# Altium project python project v2.0.PrjPcb (part 1 of 2)
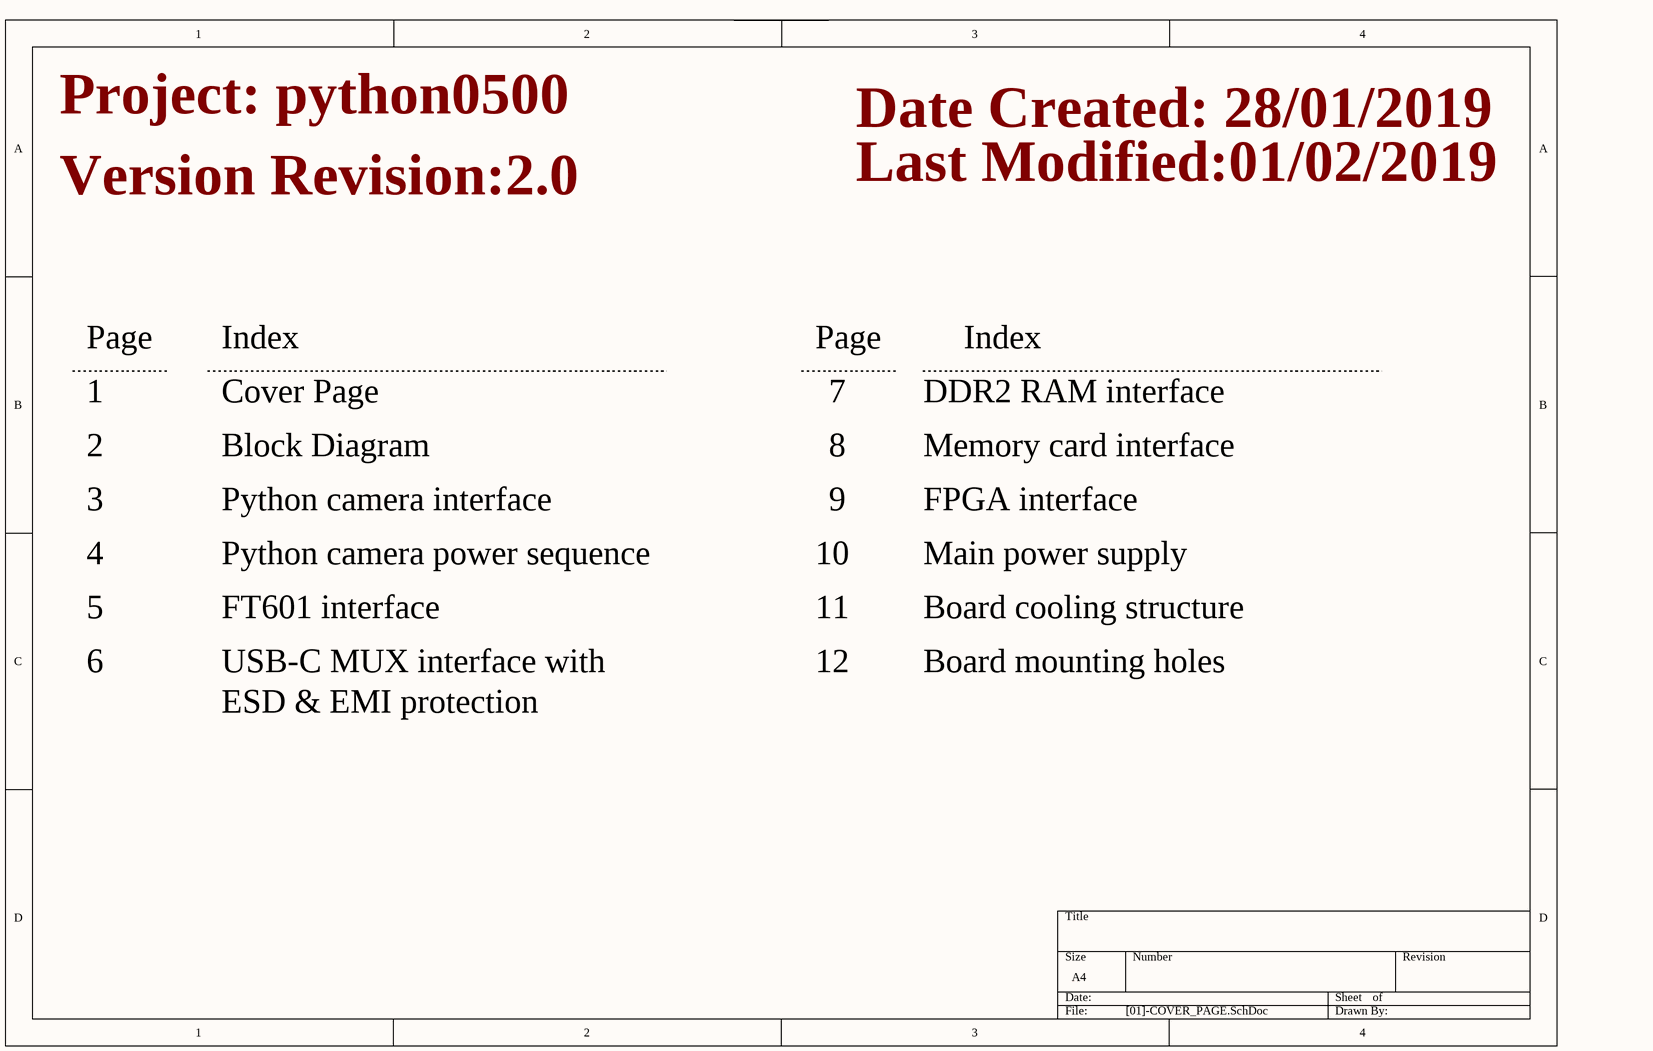
[diagram p0: [01]-COVER_PAGE.SchDoc]
17 sheets, 320 parts. Net scope: flat (ports and power ports of the same name join across sheets).
Board file: python project v2.0.PcbDoc
Sheets:
  [01]-COVER_PAGE.SchDoc
  [02]-BLOCK_DIAGRAM.SchDoc
  [03]-Python_Camera_Interface.SchDoc
  [04]-FT601_USB_Tx_Rx_Interface.SchDoc
  [05]-USB_C_MUX_Interface.SchDoc
  [06]-DDR2_Interface.SchDoc
  [07]-SDcard_Testpoints_Ext_SPI_Interface.SchDoc
  [08]-FPGA_Bank_1_Interface.SchDoc
  [09]-FPGA_Bank_2_Interface.SchDoc
  [10]-FPGA_Bank_3_Interface.SchDoc
  [11]-FPGA_Bank_4_Interface.SchDoc
  [12]-FPGA_Bank_5_Interface.SchDoc
  [13]-FPGA_Bank_6_Interface.SchDoc
  [14]-FPGA_Bank_7_Interface.SchDoc
  [15]-FPGA_Bank_8_Interface.SchDoc
  [16]-DDR2_Power_Supply.SchDoc
  [17]-FPGA_Power_Supply.SchDoc

## Sheet [01]-COVER_PAGE.SchDoc
size A4

### Notes on the sheet
- Project: python0500
- Date Created: 28/01/2019
- Last Modified:01/02/2019
- Version Revision:2.0
- Page
- Index
- 1
- 2
- Cover Page
- Block Diagram
- 7
- 8
- DDR2 RAM interface
- Memory card interface
- 3
- Python camera interface
- 9
- FPGA interface
- 4
- Python camera power sequence
- 10
- Main power supply
- 5
- FT601 interface
- 11
- Board cooling structure
- 6
- USB-C MUX interface with
- ESD & EMI protection
- 12
- Board mounting holes

## Sheet [02]-BLOCK_DIAGRAM.SchDoc
size A4
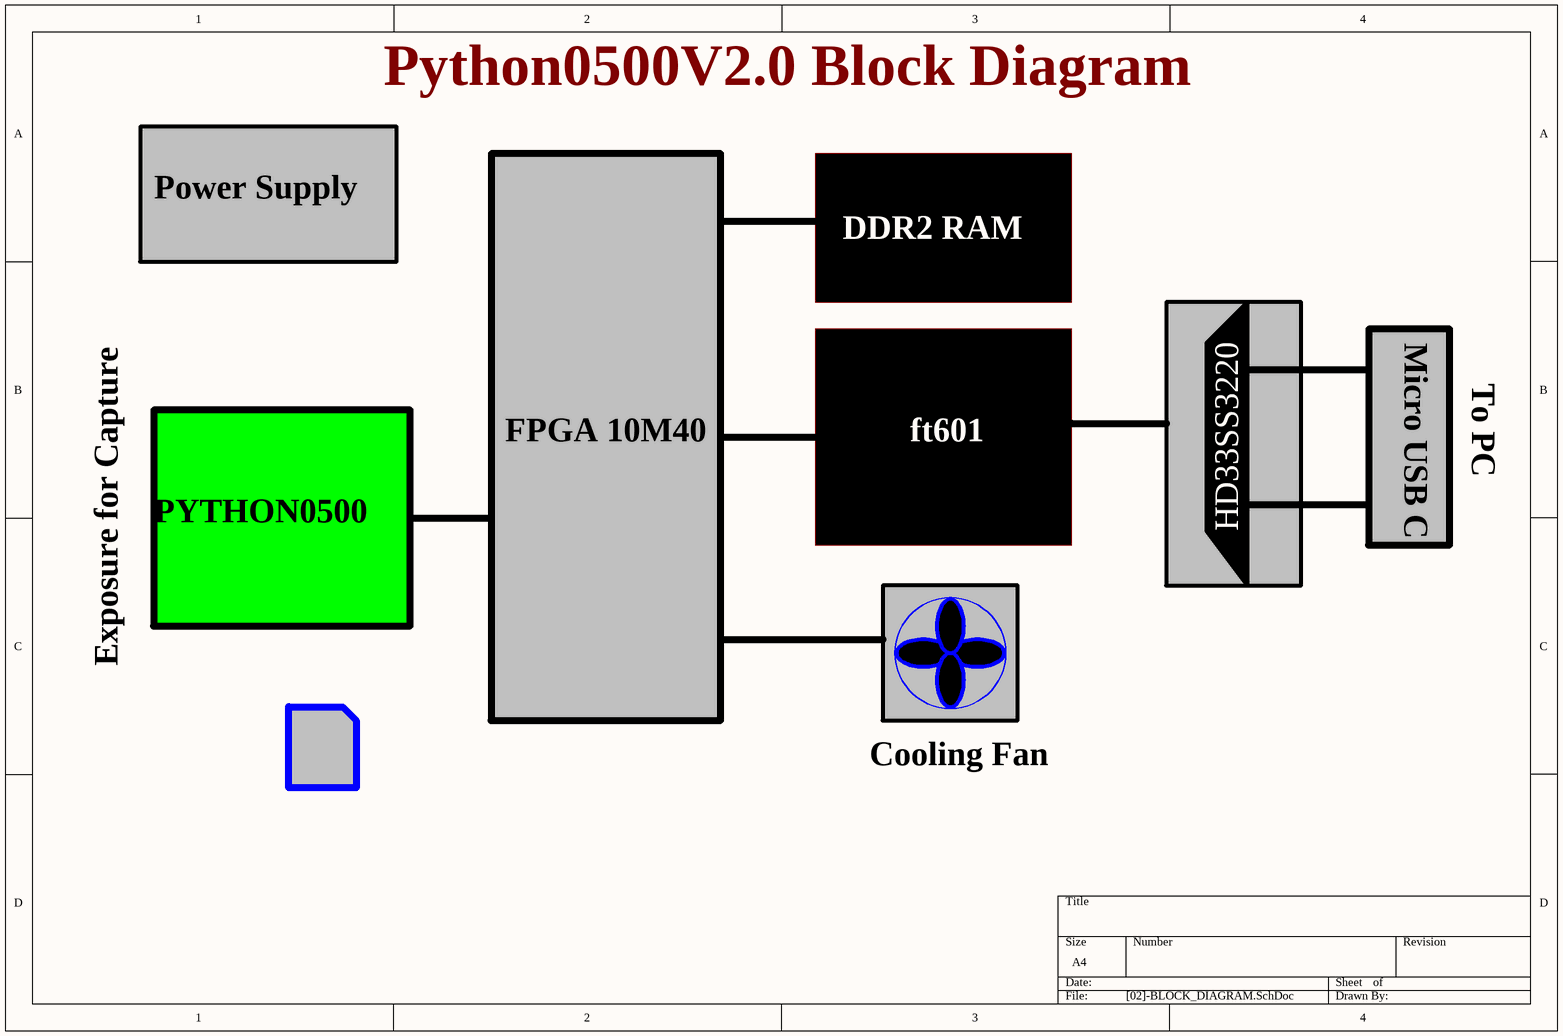
[diagram p1: [02]-BLOCK_DIAGRAM.SchDoc]

### Notes on the sheet
- Python0500V2.0 Block Diagram
- Power Supply
- DDR2 RAM
- Micro USB C
- To PC
- FPGA 10M40
- ft601
- PYTHON0500
- HD33SS3220
- Exposure for Capture
- Cooling Fan

## Sheet [03]-Python_Camera_Interface.SchDoc
size A4
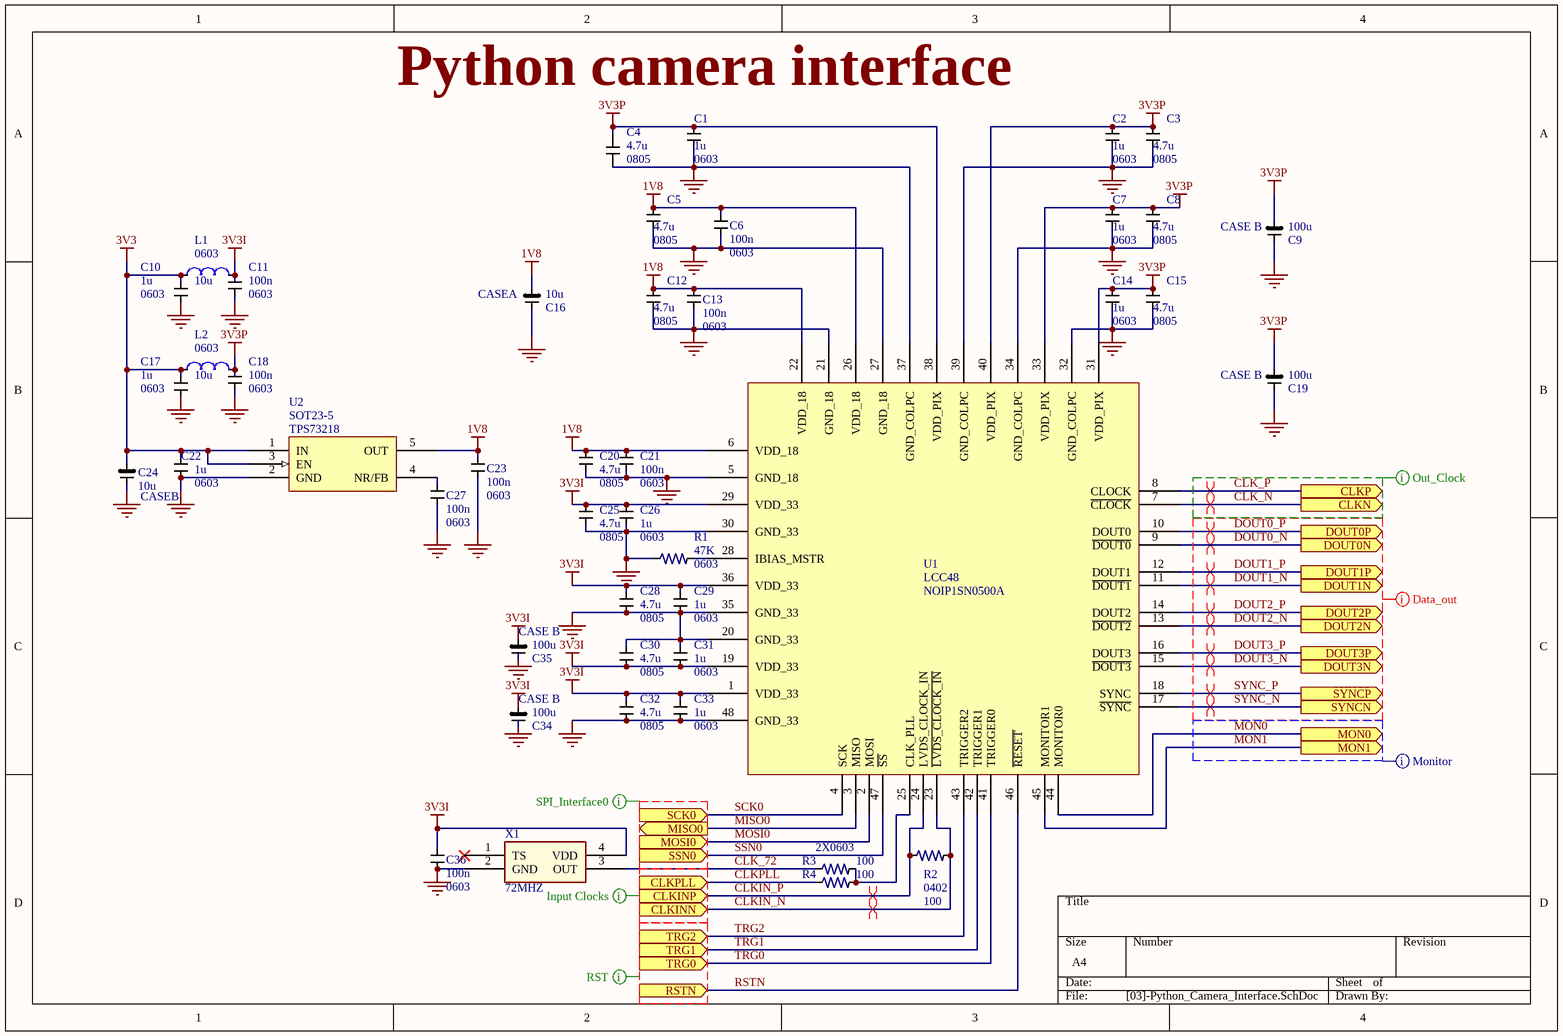
[diagram p2: [03]-Python_Camera_Interface.SchDoc]

### Parts
C1  1u  PCB Layer:: 0603  [*0603]
C2  1u  PCB Layer:: 0603  [*0603]
C3  4.7u  PCB Package: 0805  [*CAPC2013X140N]
C4  4.7u  PCB Package: 0805  [*CAPC2013X140N]
C5  4.7u  PCB Package: 0805  [*CAPC2013X140N]
C6  100n  PCB package type: 0603  [*CAPC1608X90N]
C7  1u  PCB Layer:: 0603  [*0603]
C8  4.7u  PCB Package: 0805  [*CAPC2013X140N]
C9  100u  CASE: CASE B  [CAPC3529X21N]
C10  1u  PCB size: 0603
C11  100n  PCB package type: 0603  [*CAPC1608X90N]
C12  4.7u  PCB Package: 0805  [*CAPC2013X140N]
C13  100n  PCB package type: 0603  [*CAPC1608X90N]
C14  1u  PCB Layer:: 0603  [*0603]
C15  4.7u  PCB Package: 0805  [*CAPC2013X140N]
C16  10u  CASE Type:: CASEA  [CAPCP3216X18N]
C17  1u  PCB size: 0603
C18  100n  PCB package type: 0603  [*CAPC1608X90N]
C19  100u  CASE: CASE B  [CAPC3529X21N]
C20  4.7u  PCB Package: 0805  [*CAPC2013X140N]
C21  100n  PCB package type: 0603  [*CAPC1608X90N]
C22  1u  PCB Layer:: 0603  [*0603]
C23  100n  PCB package type: 0603  [*CAPC1608X90N]
C24  10u  PCB layer: CASEB  [CAPC3528X21N]
C25  4.7u  PCB Package: 0805  [*CAPC2013X140N]
C26  1u  PCB Layer:: 0603  [*0603]
C27  100n  PCB package type: 0603  [*CAPC1608X90N]
C28  4.7u  PCB Package: 0805  [*CAPC2013X140N]
C29  1u  PCB Layer:: 0603  [*0603]
C30  4.7u  PCB Package: 0805  [*CAPC2013X140N]
C31  1u  PCB Layer:: 0603  [*0603]
C32  4.7u  PCB Package: 0805  [*CAPC2013X140N]
C33  1u  PCB Layer:: 0603  [*0603]
C34  100u  CASE: CASE B  [CAPC3529X21N]
C35  100u  CASE: CASE B  [CAPC3529X21N]
C36  100n  PCB package type: 0603  [*CAPC1608X90N]
L1  10u  PCB Layout:: 0603  [*INDC1608X95N]
L2  10u  PCB Layout:: 0603  [*INDC1608X95N]
R1  47K  foot print: 0603  [*0603]
R2  100  PCB footprint: 0402  [*R0402]
R3  100  foot print: 2X0603  [*0603]
R4  100  [*0603]
U1  NOIP1SN0500A  package type: LCC48  [LCC101P1430X1430X228-48N]
U2  TPS73218  PCB Footprint type:: SOT23-5  [*SOT95P280X145-5N]
X1  72MHZ  [OSCSC320X250X100N]

### Ports
CLKINN (in), CLKINP (in), CLKN (out), CLKP (out), CLKPLL (in), DOUT0N (out), DOUT0P (out), DOUT1N (out), DOUT1P (out), DOUT2N (out), DOUT2P (out), DOUT3N (out), DOUT3P (out), MISO0 (out), MON0 (out), MON1 (out), MOSI0 (in), RSTN (in), SCK0 (in), SSN0 (in), SYNCN (out), SYNCP (out), TRG0 (in), TRG1 (in), TRG2 (in)

### Nets
1V8: C5.2 C6.2 C12.2 C13.2 C16.1 C20.2 C21.2 C23.2 U1.6(VDD_18) U1.22(VDD_18) U1.26(VDD_18) U2.5(OUT)
3V3: C10.2 C17.2 C22.2 C24.1 L1.1 L2.1 U2.1(IN) U2.3(EN)
3V3I: C11.2 C25.2 C26.2 C28.2 C29.2 C30.1 C31.1 C32.2 C33.2 C34.1 C35.1 C36.2 L1.2 U1.1(VDD_33) U1.19(VDD_33) U1.29(VDD_33) U1.36(VDD_33) X1.4(VDD)
3V3P: C1.2 C2.2 C3.2 C4.1 C7.2 C8.2 C9.1 C14.2 C15.2 C18.2 C19.1 L2.2 U1.31(VDD_PIX) U1.33(VDD_PIX) U1.38(VDD_PIX) U1.40(VDD_PIX)
GND: C1.1 C2.1 C3.1 C4.2 C5.1 C6.1 C7.1 C8.1 C9.2 C10.1 C11.1 C12.1 C13.1 C14.1 C15.1 C16.2 C17.1 C18.1 C19.2 C20.1 C21.1 C22.1 C23.1 C24.2 C25.1 C26.1 C27.1 C28.1 C29.1 C30.2 C31.2 C32.1 C33.1 C34.2 C35.2 C36.1 R1.1 U1.5(GND_18) U1.20(GND_33) U1.21(GND_18) U1.27(GND_18) U1.30(GND_33) U1.32(GND_COLPC) U1.34(GND_COLPC) U1.35(GND_33) U1.37(GND_COLPC) U1.39(GND_COLPC) U1.48(GND_33) U2.2(GND) X1.2(GND)
CLK_72: R3.1 X1.3(OUT)
CLK_N: U1.7(~{CLOCK}) ; port CLKN
CLK_P: U1.8(CLOCK) ; port CLKP
CLKIN_N: R2.2 U1.23(~{LVDS_CLOCK_}~{IN}) ; port CLKINN
CLKIN_P: R2.1 U1.24(LVDS_CLOCK_IN) ; port CLKINP
CLKPLL: R4.1 ; port CLKPLL
DOUT0_N: U1.9(~{DOUT0}) ; port DOUT0N
DOUT0_P: U1.10(DOUT0) ; port DOUT0P
DOUT1_N: U1.11(~{DOUT1}) ; port DOUT1N
DOUT1_P: U1.12(DOUT1) ; port DOUT1P
DOUT2_N: U1.13(~{DOUT2}) ; port DOUT2N
DOUT2_P: U1.14(DOUT2) ; port DOUT2P
DOUT3_N: U1.15(~{DOUT3}) ; port DOUT3N
DOUT3_P: U1.16(DOUT3) ; port DOUT3P
MISO0: U1.3(MISO) ; port MISO0
MON0: U1.44(MONITOR0) ; port MON0
MON1: U1.45(MONITOR1) ; port MON1
MOSI0: U1.2(MOSI) ; port MOSI0
RSTN: U1.46(~{RESET}) ; port RSTN
SCK0: U1.4(SCK) ; port SCK0
SSN0: U1.47(~{SS}) ; port SSN0
SYNC_N: U1.17(~{SYNC}) ; port SYNCN
SYNC_P: U1.18(SYNC) ; port SYNCP
TRG0: U1.41(TRIGGER0) ; port TRG0
TRG1: U1.42(TRIGGER1) ; port TRG1
TRG2: U1.43(TRIGGER2) ; port TRG2
NetC27_2: C27.2 U2.4(NR/FB)
NetR1_2: R1.2 U1.28(IBIAS_MSTR)
NetR3_2: R3.2 R4.2 U1.25(CLK_PLL)

Not connected (* = marked no-connect by the designer): X1 1(TS)*

### Layout directives
differential pair: CLK_N, CLK_P, CLKIN_N, CLKIN_P, DOUT0_N, DOUT0_P, DOUT1_N, DOUT1_P, DOUT2_N, DOUT2_P, DOUT3_N, DOUT3_P, SYNC_N, SYNC_P
mark named Out_Clock: CLK_N, CLK_P
mark named Data_out: DOUT0_N, DOUT0_P, DOUT1_N, DOUT1_P, DOUT2_N, DOUT2_P, DOUT3_N, DOUT3_P, SYNC_N, SYNC_P
mark named Monitor: MON0, MON1
mark named RST: (no net found under the mark)
mark named Input Clocks: CLKIN_P
mark named SPI_Interface0: (no net found under the mark)

### Notes on the sheet
- Python camera interface

### Library data of the parts
C1-C36 L1 L2 U2 = Component_1
  C1 C2 C7 C14 C22 C26 C29 C31 C33: Buying URL:: https://uk.farnell.com/avx/0603yc105kat2a/cap-1-f-16v-10-x7r-0603/dp/1658870RL?st=1u%200603
  C3-C5 C8 C12 C15 C20 C25 C28 C30 C32: Buying URL:: https://uk.farnell.com/avx/08053d475kat2a/cap-4-7-f-25v-10-x5r-0805/dp/1657932?st=4.7u%200805
  C6 C11 C13 C18 C21 C23 C27 C36: Buying URL:: https://uk.farnell.com/murata/grm188r71h104ka93d/cap-0-1-f-50v-10-x7r-0603-reel/dp/2408527?st=GRM188R71H104KA93D
  C9 C19 C34 C35: Buying URL:: https://uk.farnell.com/avx/tajb107k006tnj/cap-tant-aec-q200-100uf-6-3v-case/dp/2893386?st=100u%20CASE%20B
  C10 C17: Buying URL: https://uk.farnell.com/avx/0402zd105kat2a/cap-1-f-10v-10-x5r-0402/dp/1740588?st=1u%20capsitor
  C16: buying URL:: https://uk.farnell.com/kemet/t491a106m004at/cap-tantalum-10uf-4v-case-a/dp/2676170?st=T491A106M004AT
  L1 L2: Buying URL:: https://uk.farnell.com/tdk/mlz1608m100wt/inductor-10uh-20-shielded/dp/2215635?st=10uH%200603
  U2: Buying URL:: https://uk.farnell.com/texas-instruments/tps73218dbvt/ldo-fixed-1-8v-150ma-sot-23-5/dp/2323599RL?st=TPS73218
R1 R3 = RP73D1J76R8BTDG: Res Thin Film 0603 76.8 Ohm 0.1% 1/10W Â±15ppm/Â°C Molded SMD Paper T/R; MF: TE Connectivity / Holsworthy; Design by: Faheem; Price: None; MP: RP73D1J76R8BTDG; Package: 0603 TE Connectivity / AMP; SnapEDA_Link: https://www.snapeda.com/parts/RP73D1J76R8BTDG/TE%20Connectivity%20/%20Holsworthy/view-part/?ref=snap; Value: *; Buying URL:: https://uk.farnell.com/vishay/crcw060347k0fkea/res-47k-1-0-1w-0603-thick-film/dp/1469811?st=47K%200603; Availability: Unavailable
R2 = RP73D1J76R8BTDG: Res Thin Film 0603 76.8 Ohm 0.1% 1/10W Â±15ppm/Â°C Molded SMD Paper T/R; Buying URL:: https://uk.farnell.com/yageo/rc0402fr-07100rl/res-100r-1-0-0625w-0402-thick/dp/9239111
R4 = RP73D1J76R8BTDG: Res Thin Film 0603 76.8 Ohm 0.1% 1/10W Â±15ppm/Â°C Molded SMD Paper T/R; MF: TE Connectivity / Holsworthy; Design by: Faheem; foot print: 0603; Price: None; MP: RP73D1J76R8BTDG; Package: 0603 TE Connectivity / AMP; SnapEDA_Link: https://www.snapeda.com/parts/RP73D1J76R8BTDG/TE%20Connectivity%20/%20Holsworthy/view-part/?ref=snap; Value: *; Buying URL:: https://uk.farnell.com/vishay/crcw060347k0fkea/res-47k-1-0-1w-0603-thick-film/dp/1469811?st=47K%200603; Availability: Unavailable
U1 = Component_1: Python camera sensor. Having pixel output of 500 by 600.; Part No.: NOIP1SN0500A-QDI; Manufactured by: OnSemi; Designer: Faheem; Company: PhasePhotonics; Data Sheet URL:: https://www.onsemi.com/pub/Collateral/NOIP1SN1300A-D.PDF; Buying URL:: https://uk.farnell.com/on-semiconductor/noip1sn0500a-qdi/image-sensor-rbg-800-x-600-lcc/dp/2727907?ost=NOIP1SN0500A&ddkey=https%3Aen-GB%2FElement14_United_Kingdom%2Fsearch; Package Type: LCC. required LCC socket as well.; Date Created: 04/02/2019; PCB footprint download: https://www.snapeda.com/parts/NOIP1SN0500A-QDI/ON%20Semiconductor/view-part/?ref=search&t=NOIP1SN0500A; 3D Model: http://www.3dcontentcentral.com/secure/download-model.aspx?catalogid=171&id=343978
X1 = Component_1: mf_part no.: ASFLMB-72.000MHZ-XY-T; Manufactured by: ABRACON

## Sheet [04]-FT601_USB_Tx_Rx_Interface.SchDoc
size A3
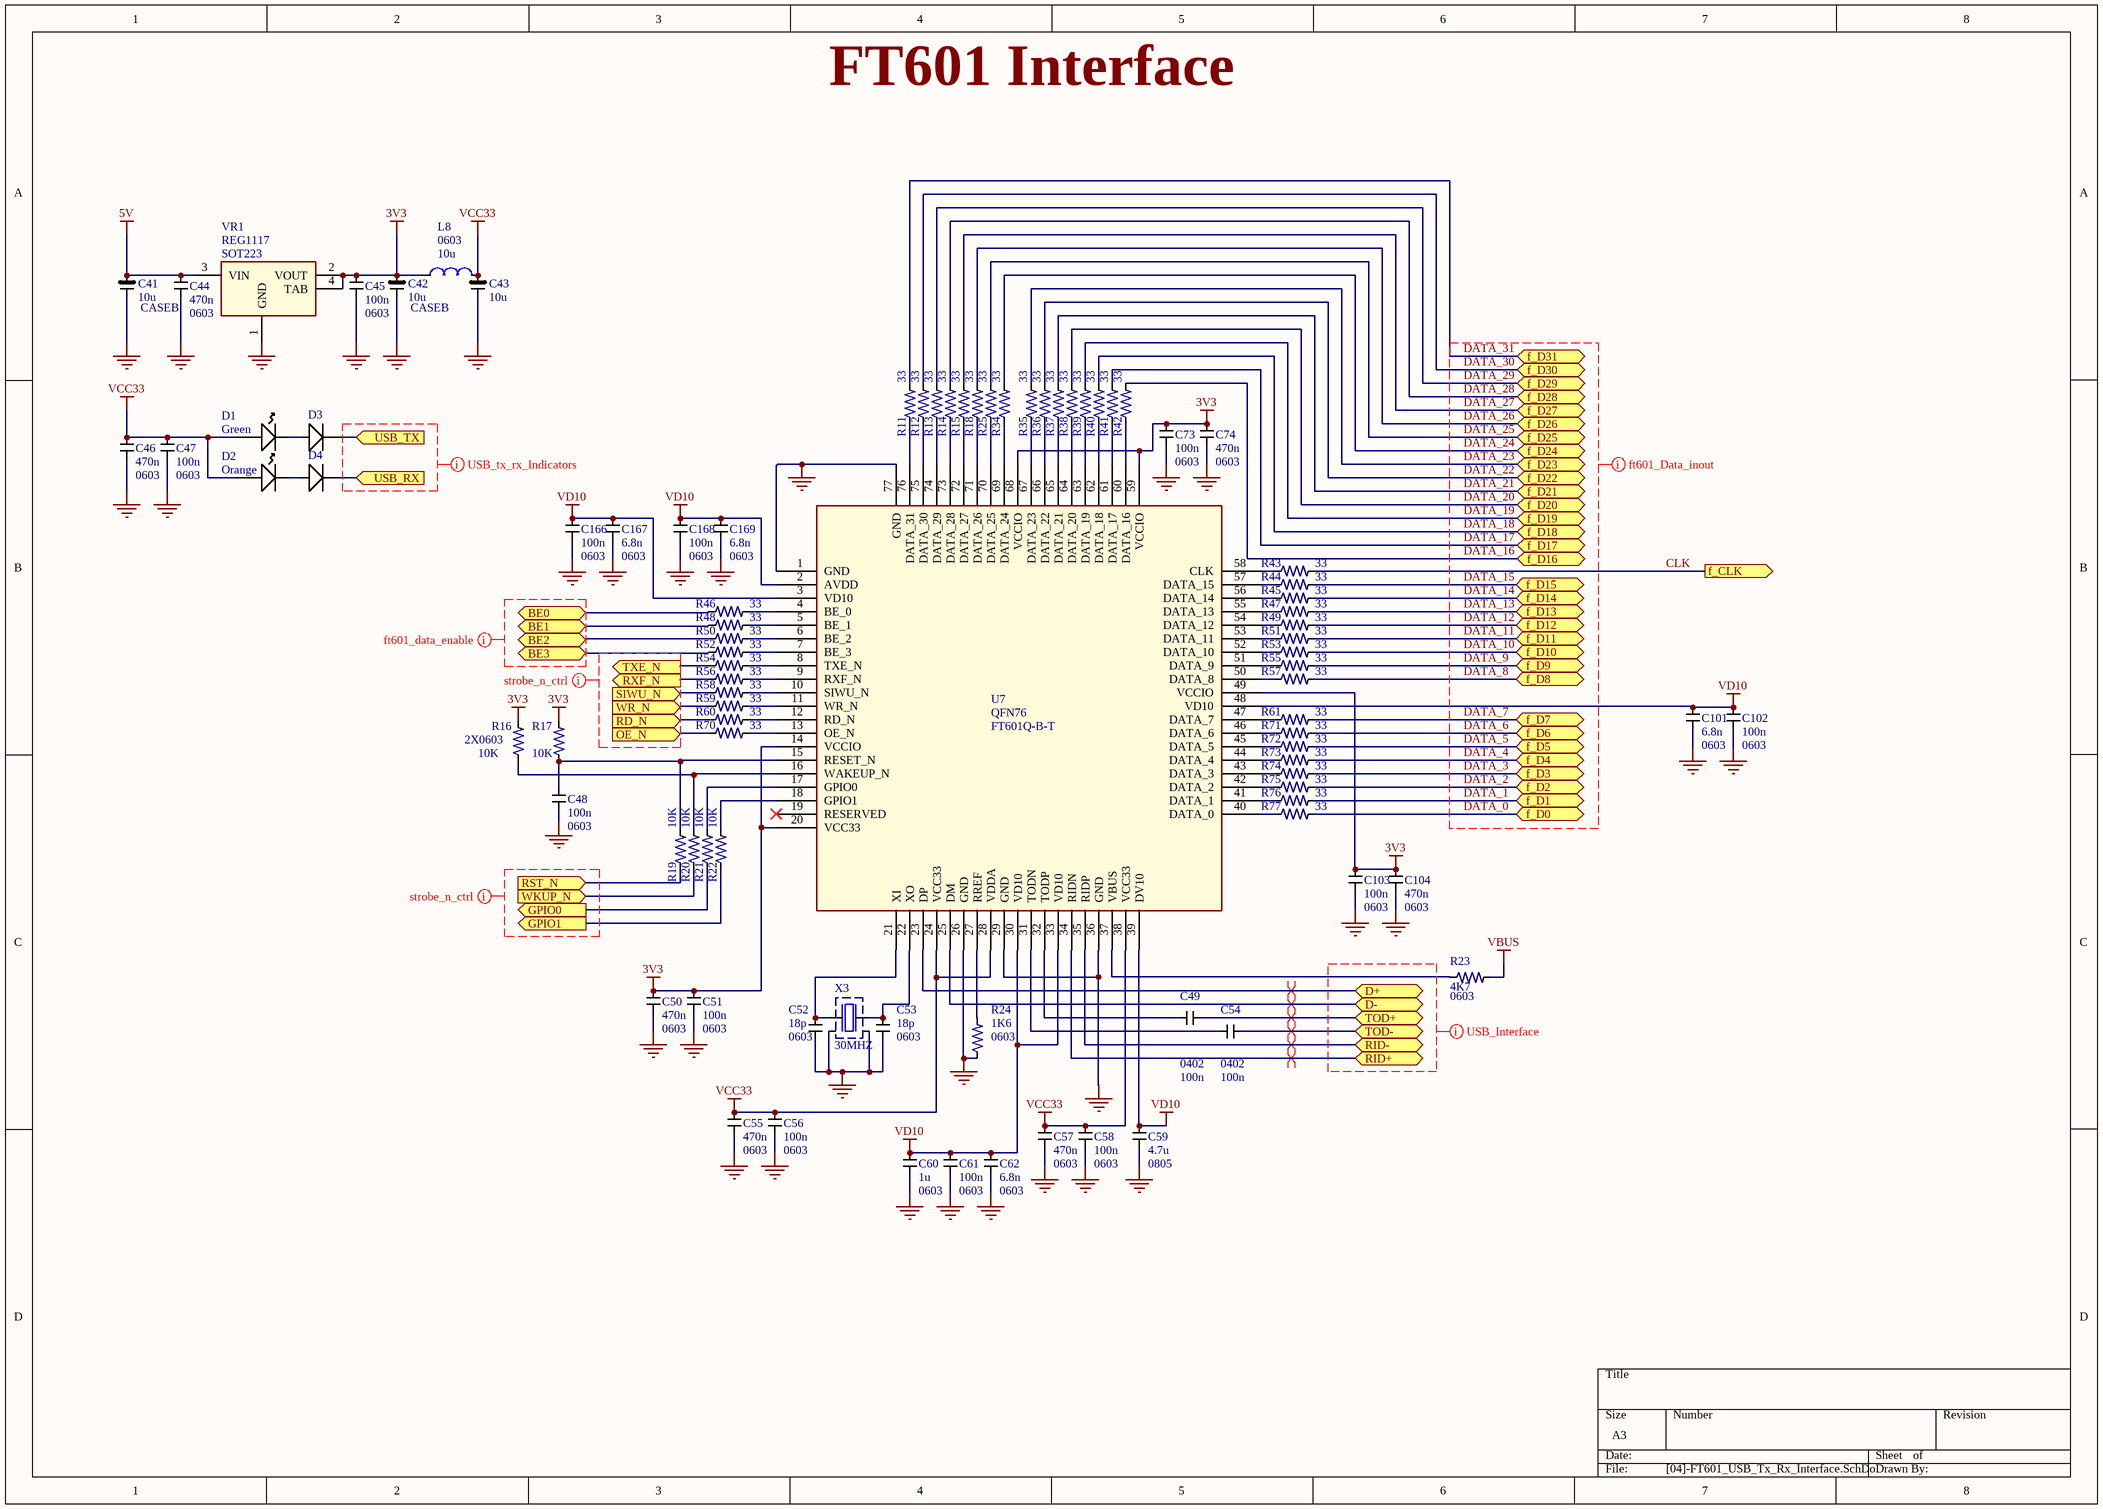
[diagram p3: [04]-FT601_USB_Tx_Rx_Interface.SchDoc]

### Parts
C41  10u  PCB layer: CASEB  [CAPC3528X21N]
C42  10u  PCB layer: CASEB  [CAPC3528X21N]
C43  10u  [CAPC3528X21N]
C44  470n  PCB footprint: 0603
C45  100n  PCB footprint: 0603
C46  470n  PCB footprint: 0603
C47  100n  PCB footprint: 0603
C48  100n  PCB footprint: 0603
C49  100n  PCB Stake: 0402  [*CAPC1005X60N]
C50  470n  PCB footprint: 0603
C51  100n  PCB footprint: 0603
C52  18p  PCB layout:: 0603  [*CAPC1608X90]
C53  18p  PCB layout:: 0603  [*CAPC1608X90]
C54  100n  PCB Stake: 0402  [*CAPC1005X60N]
C55  470n  PCB footprint: 0603
C56  100n  PCB footprint: 0603
C57  470n  PCB footprint: 0603
C58  100n  PCB footprint: 0603
C59  4.7u  PCB Package: 0805  [*CAPC2013X140N]
C60  1u  PCB footprint: 0603
C61  100n  PCB Package: 0603  [CAPC1608X10N]
C62  6.8n  PCB Layer:: 0603  [*0603]
C73  100n  PCB footprint: 0603
C74  470n  PCB footprint: 0603
C101  6.8n  PCB Package: 0603  [CAPC1608X10N]
C102  100n  PCB footprint: 0603
C103  100n  PCB footprint: 0603
C104  470n  PCB footprint: 0603
C166  100n  PCB footprint: 0603
C167  6.8n  PCB footprint: 0603
C168  100n  PCB footprint: 0603
C169  6.8n  PCB footprint: 0603
D1  Color: Green  [LED1913X12NGREEN]  (hidden comment: Kingbright Green LED, 70 mcd 120 ° 0805)
D2  Color: Orange  [LED1913X12NYEL/ORANGE]  (hidden comment: Kingbright Orange LED, 200 mcd 120 ° 0805)
D3  Panasonic DB2J20900L Schottky Diode, 0.5A, 20V, 2.4ns, 2-Pin SMini2 F5 B  [DIOM1712X07N]  (value not drawn)
D4  Panasonic DB2J20900L Schottky Diode, 0.5A, 20V, 2.4ns, 2-Pin SMini2 F5 B  [DIOM1712X07N]  (value not drawn)
L8  10u  PCB Layout:: 0603  [*INDC1608X95N]
R11  33  [*R0402]
R12  33  [*R0402]
R13  33  [*R0402]
R14  33  [*R0402]
R15  33  [*R0402]
R16  10K  foot print: 2X0603  [*0603]
R17  10K  [*0603]
R18  33  [*R0402]
R19  10K  [*0603]
R20  10K  [*0603]
R21  10K  [*0603]
R22  10K  [*0603]
R23  4K7  foot print: 0603  [*RESC1608X50N]
R24  1K6  foot print: 0603  [*0603]
R25  33  [*R0402]
R34  33  [*R0402]
R35  33  [*R0402]
R36  33  [*R0402]
R37  33  [*R0402]
R38  33  [*R0402]
R39  33  [*R0402]
R40  33  [*R0402]
R41  33  [*R0402]
R42  33  [*R0402]
R43  33  [*R0402]
R44  33  [*R0402]
R45  33  [*R0402]
R46  33  [*R0402]
R47  33  [*R0402]
R48  33  [*R0402]
R49  33  [*R0402]
R50  33  [*R0402]
R51  33  [*R0402]
R52  33  [*R0402]
R53  33  [*R0402]
R54  33  [*R0402]
R55  33  [*R0402]
R56  33  [*R0402]
R57  33  [*R0402]
R58  33  [*R0402]
R59  33  [*R0402]
R60  33  [*R0402]
R61  33  [*R0402]
R70  33  [*R0402]
R71  33  [*R0402]
R72  33  [*R0402]
R73  33  [*R0402]
R74  33  [*R0402]
R75  33  [*R0402]
R76  33  [*R0402]
R77  33  [*R0402]
U7  FT601Q-B-T  Package Type:: QFN76  [QFN40P900X900X100-77N]
VR1  REG1117  PCB lAYOUT:: SOT223  [*SOT223]
X3  30MHZ  [OSC_DSC6083CI2A-032K768]

### Ports
BE0 (bidir), BE1 (bidir), BE2 (bidir), BE3 (bidir), D+ (bidir), D- (bidir), f_CLK (out), f_D0 (bidir), f_D1 (bidir), f_D2 (bidir), f_D3 (bidir), f_D4 (bidir), f_D5 (bidir), f_D6 (bidir), f_D7 (bidir), f_D8 (bidir), f_D9 (bidir), f_D10 (bidir), f_D11 (bidir), f_D12 (bidir), f_D13 (bidir), f_D14 (bidir), f_D15 (bidir), f_D16 (bidir), f_D17 (bidir), f_D18 (bidir), f_D19 (bidir), f_D20 (bidir), f_D21 (bidir), f_D22 (bidir), f_D23 (bidir), f_D24 (bidir), f_D25 (bidir), f_D26 (bidir), f_D27 (bidir), f_D28 (bidir), f_D29 (bidir), f_D30 (bidir), f_D31 (bidir), GPIO0 (out), GPIO1 (out), OE_N (in), RD_N (in), RID+ (bidir), RID- (bidir), RST_N (in), RXF_N (out), SIWU_N (in), TOD+ (bidir), TOD- (bidir), TXE_N (out), USB_RX (in), USB_TX (in), WKUP_N (in), WR_N (in)

### Nets
3V3: C42.1 C45.2 C50.2 C51.2 C73.2 C74.2 C103.2 C104.2 L8.1 R16.2 R17.2 U7.14(VCCIO) U7.20(VCC33) U7.49(VCCIO) U7.59(VCCIO) U7.68(VCCIO) VR1.2(VOUT) VR1.4(TAB)
5V: C41.1 C44.2 VR1.3(VIN)
GND: C41.2 C42.2 C43.2 C44.1 C45.1 C46.1 C47.1 C48.1 C50.1 C51.1 C52.1 C53.1 C55.1 C56.1 C57.1 C58.1 C59.1 C60.1 C61.1 C62.1 C73.1 C74.1 C101.1 C102.1 C103.1 C104.1 C166.1 C167.1 C168.1 C169.1 R24.1 U7.1(GND) U7.26(GND) U7.29(GND) U7.36(GND) U7.77(GND) VR1.1(GND) X3.2(Gnd) X3.4(Gnd)
VBUS: R23.2
VCC33: C43.1 C46.2 C47.2 C55.2 C56.2 C57.2 C58.2 D1.1(A) D2.1(A) L8.2 U7.24(VCC33) U7.28(VDDA) U7.38(VCC33)
VD10: C59.2 C60.2 C61.2 C62.2 C101.2 C102.2 C166.2 C167.2 C168.2 C169.2 U7.2(AVDD) U7.3(VD10) U7.30(VD10) U7.33(VD10) U7.39(DV10) U7.48(VD10)
CLK: R43.2 ; port f_CLK
D_N: U7.25(DM) ; port D-
D_P: U7.23(DP) ; port D+
DATA_0: R77.2 ; port f_D0
DATA_1: R76.2 ; port f_D1
DATA_2: R75.2 ; port f_D2
DATA_3: R74.2 ; port f_D3
DATA_4: R73.2 ; port f_D4
DATA_5: R72.2 ; port f_D5
DATA_6: R71.2 ; port f_D6
DATA_7: R61.2 ; port f_D7
DATA_8: R57.2 ; port f_D8
DATA_9: R55.2 ; port f_D9
DATA_10: R53.2 ; port f_D10
DATA_11: R51.2 ; port f_D11
DATA_12: R49.2 ; port f_D12
DATA_13: R47.2 ; port f_D13
DATA_14: R45.2 ; port f_D14
DATA_15: R44.2 ; port f_D15
DATA_16: R42.2 ; port f_D16
DATA_17: R41.2 ; port f_D17
DATA_18: R40.2 ; port f_D18
DATA_19: R39.2 ; port f_D19
DATA_20: R38.2 ; port f_D20
DATA_21: R37.2 ; port f_D21
DATA_22: R36.2 ; port f_D22
DATA_23: R35.2 ; port f_D23
DATA_24: R34.2 ; port f_D24
DATA_25: R25.2 ; port f_D25
DATA_26: R18.2 ; port f_D26
DATA_27: R15.2 ; port f_D27
DATA_28: R14.2 ; port f_D28
DATA_29: R13.2 ; port f_D29
DATA_30: R12.2 ; port f_D30
DATA_31: R11.2 ; port f_D31
RID_N: U7.35(RIDP) ; port RID-
RID_P: U7.34(RIDN) ; port RID+
TOD_N: C54.1 ; port TOD-
TOD_P: C49.1 ; port TOD+
NetC48_2: C48.2 R17.1 R19.2 U7.15(RESET_N)
NetC49_2: C49.2 U7.32(TODP)
NetC52_2: C52.2 U7.21(XI) X3.1
NetC53_2: C53.2 U7.22(XO) X3.3
NetC54_2: C54.2 U7.31(TODN)
NetD1_2: D1.2(K) D3.2
NetD2_2: D2.2(K) D4.2
NetD3_1: D3.1 ; port USB_TX
NetD4_1: D4.1 ; port USB_RX
NetR11_1: R11.1 U7.76(DATA_31)
NetR12_1: R12.1 U7.75(DATA_30)
NetR13_1: R13.1 U7.74(DATA_29)
NetR14_1: R14.1 U7.73(DATA_28)
NetR15_1: R15.1 U7.72(DATA_27)
NetR16_1: R16.1 R20.2 U7.16(WAKEUP_N)
NetR18_1: R18.1 U7.71(DATA_26)
NetR19_1: R19.1 ; port RST_N
NetR20_1: R20.1 ; port WKUP_N
NetR21_1: R21.1 ; port GPIO0
NetR21_2: R21.2 U7.17(GPIO0)
NetR22_1: R22.1 ; port GPIO1
NetR22_2: R22.2 U7.18(GPIO1)
NetR23_1: R23.1 U7.37(VBUS)
NetR24_2: R24.2 U7.27(RREF)
NetR25_1: R25.1 U7.70(DATA_25)
NetR34_1: R34.1 U7.69(DATA_24)
NetR35_1: R35.1 U7.67(DATA_23)
NetR36_1: R36.1 U7.66(DATA_22)
NetR37_1: R37.1 U7.65(DATA_21)
NetR38_1: R38.1 U7.64(DATA_20)
NetR39_1: R39.1 U7.63(DATA_19)
NetR40_1: R40.1 U7.62(DATA_18)
NetR41_1: R41.1 U7.61(DATA_17)
NetR42_1: R42.1 U7.60(DATA_16)
NetR43_1: R43.1 U7.58(CLK)
NetR44_1: R44.1 U7.57(DATA_15)
NetR45_1: R45.1 U7.56(DATA_14)
NetR46_1: R46.1 ; port BE0
NetR46_2: R46.2 U7.4(BE_0)
NetR47_1: R47.1 U7.55(DATA_13)
NetR48_1: R48.1 ; port BE1
NetR48_2: R48.2 U7.5(BE_1)
NetR49_1: R49.1 U7.54(DATA_12)
NetR50_1: R50.1 ; port BE2
NetR50_2: R50.2 U7.6(BE_2)
NetR51_1: R51.1 U7.53(DATA_11)
NetR52_1: R52.1 ; port BE3
NetR52_2: R52.2 U7.7(BE_3)
NetR53_1: R53.1 U7.52(DATA_10)
NetR54_1: R54.1 ; port TXE_N
NetR54_2: R54.2 U7.8(TXE_N)
NetR55_1: R55.1 U7.51(DATA_9)
NetR56_1: R56.1 ; port RXF_N
NetR56_2: R56.2 U7.9(RXF_N)
NetR57_1: R57.1 U7.50(DATA_8)
NetR58_1: R58.1 ; port SIWU_N
NetR58_2: R58.2 U7.10(SIWU_N)
NetR59_1: R59.1 ; port WR_N
NetR59_2: R59.2 U7.11(WR_N)
NetR60_1: R60.1 ; port RD_N
NetR60_2: R60.2 U7.12(RD_N)
NetR61_1: R61.1 U7.47(DATA_7)
NetR70_1: R70.1 ; port OE_N
NetR70_2: R70.2 U7.13(OE_N)
NetR71_1: R71.1 U7.46(DATA_6)
NetR72_1: R72.1 U7.45(DATA_5)
NetR73_1: R73.1 U7.44(DATA_4)
NetR74_1: R74.1 U7.43(DATA_3)
NetR75_1: R75.1 U7.42(DATA_2)
NetR76_1: R76.1 U7.41(DATA_1)
NetR77_1: R77.1 U7.40(DATA_0)

Not connected (* = marked no-connect by the designer): U7 19(RESERVED)*

### Layout directives
differential pair: D_N, D_P, RID_N, RID_P, TOD_N, TOD_P
mark named ft601_Data_inout: DATA_0, DATA_1, DATA_2, DATA_3, DATA_4, DATA_5, DATA_6, DATA_7, DATA_8, DATA_9, DATA_10, DATA_11, DATA_12, DATA_13, DATA_14, DATA_15, DATA_16, DATA_17, DATA_18, DATA_19, DATA_20, DATA_21, DATA_22, DATA_23, DATA_24, DATA_25, DATA_26, DATA_27, DATA_28, DATA_29, DATA_30, DATA_31
mark named USB_Interface: (no net found under the mark)
mark named USB_tx_rx_Indicators: (no net found under the mark)
mark named ft601_data_enable: (no net found under the mark)
mark named strobe_n_ctrl: (no net found under the mark)

### Notes on the sheet
- FT601 Interface

### Library data of the parts
C41-C62 C73 C74 C101-C104 C166-C169 L8 = Component_1
  C44-C48 C50 C51 C55-C58 C60 C73 C74 C102-C104 C166-C169: Buying URL:: https://uk.farnell.com/avx/06031c104kat2a/cap-0-1-f-100v-10-x7r-0603/dp/2749806?st=100nf
  C49 C54: Buying URL:: https://uk.farnell.com/avx/04023c104kat2a/cap-0-1-f-25v-10-x7r-0402/dp/1867948RL
  C52 C53: Buying URL:: https://uk.farnell.com/avx/06032u180gat2a/cap-18pf-200v-2-c0g-np0-0603-smd/dp/7568339RL
  C59: Buying URL:: https://uk.farnell.com/avx/08053d475kat2a/cap-4-7-f-25v-10-x5r-0805/dp/1657932?st=4.7u%200805
  C61 C101: Buying URL:: https://uk.farnell.com/multicomp/mc0603b682k500ct/cap-6800pf-50v-10-x7r-0603/dp/1759100?st=6.8nf%200603
  C62: Buying URL:: https://uk.farnell.com/avx/0603yc105kat2a/cap-1-f-16v-10-x7r-0603/dp/1658870RL?st=1u%200603
  L8: Buying URL:: https://uk.farnell.com/tdk/mlz1608m100wt/inductor-10uh-20-shielded/dp/2215635?st=10uH%200603
D1 = Kingbright Green LED, 70 mcd 120 ° 0805: Manufacturer Part No.: KP-2012MGC; Forward Voltage: 2.1 V; Creator: Ritesh Kanjee; Date Created: 18 February 2015; Manufacturer: KingBright; RS Stock No.: 466-3778; Datasheet URL: http://za.rs-online.com/web/p/visible-leds/4663778/
D2 = Kingbright Orange LED, 200 mcd 120 ° 0805: Manufacturer Part No.: KP-2012SEC; Forward Voltage: 1.85V; Creator: Ritesh Kanjee; Date Created: 18 February 2015; Manufacturer: KingBright; RS Stock No.: 466-3790; Datasheet URL: http://za.rs-online.com/web/p/visible-leds/4663790/
D3 D4 = Schottky Diode, 0.5A, 20V, 2.4ns, 2-Pin SMini2 F5 B: Created By: R Kanjee; Date Created: 1 March 2015; Manufacturer: Panasonic; RS Stock No.: 713-2703; Manufacturer Part No.: DB2J20900L; Datasheet: http://docs-europe.electrocomponents.com/webdocs/1398/0900766b813986b3.pdf; Maximum Continuous Forward Current: 0.5A; Peak Reverse Repetitive Voltage: 20V
R11-R15 R18 R25 R34-R61 R70-R77 = RP73D1J76R8BTDG: Res Thin Film 0603 76.8 Ohm 0.1% 1/10W Â±15ppm/Â°C Molded SMD Paper T/R; PCB footprint: 0402; Buying URL:: https://uk.farnell.com/yageo/rc0402fr-07100rl/res-100r-1-0-0625w-0402-thick/dp/9239111
R16 R23 R24 = RP73D1J76R8BTDG: as R1 on sheet [03]-Python_Camera_Interface; Price: None; MP: RP73D1J76R8BTDG; Package: 0603 TE Connectivity / AMP; SnapEDA_Link: https://www.snapeda.com/parts/RP73D1J76R8BTDG/TE%20Connectivity%20/%20Holsworthy/view-part/?ref=snap; Value: *; Availability: Unavailable
  R16 R24: Buying URL:: https://uk.farnell.com/vishay/crcw060310k0fkea/res-10k-1-0-1w-0603-thick-film/dp/1469748?st=CRCW060310K0FKEA
  R23: Buying URL:: https://uk.farnell.com/te-connectivity/crgh0603f4k7/res-4k7-1-0-2w-0603-thick-film/dp/2332011?st=4.7K%200603
R17 = RP73D1J76R8BTDG: as R4 on sheet [03]-Python_Camera_Interface; Price: None; MP: RP73D1J76R8BTDG; Package: 0603 TE Connectivity / AMP; SnapEDA_Link: https://www.snapeda.com/parts/RP73D1J76R8BTDG/TE%20Connectivity%20/%20Holsworthy/view-part/?ref=snap; Value: *; Buying URL:: https://uk.farnell.com/vishay/crcw060310k0fkea/res-10k-1-0-1w-0603-thick-film/dp/1469748?st=CRCW060310K0FKEA; Availability: Unavailable
R19-R22 = RP73D1J76R8BTDG: Res Thin Film 0603 76.8 Ohm 0.1% 1/10W Â±15ppm/Â°C Molded SMD Paper T/R; MF: TE Connectivity / Holsworthy; Design by: Faheem; foot print: 0402; Price: None; MP: RP73D1J76R8BTDG; Package: 0603 TE Connectivity / AMP; SnapEDA_Link: https://www.snapeda.com/parts/RP73D1J76R8BTDG/TE%20Connectivity%20/%20Holsworthy/view-part/?ref=snap; Value: *; Buying URL:: https://uk.farnell.com/vishay/crcw060310k0fkea/res-10k-1-0-1w-0603-thick-film/dp/1469748?st=CRCW060310K0FKEA; Availability: Unavailable
U7 = FT601Q-B-T: USB3.0 to 32bit FIFO Interface Bridge QFN76 Tray; Designer: Faheem Minhas; Company: PhasePhotonics; Data Created: 21-Janruary-2019; Data sheet Link: https://www.ftdichip.com/Support/Documents/DataSheets/ICs/DS_FT600Q-FT601Q%20IC%20Datasheet.pdf; Buying Link: https://uk.farnell.com/ftdi/ft601q-b-t/interface-bridge-usb3-0-to-fifo/dp/2748207?ost=FT601Q-B-T&krypto=%2Bo46xR1L3ajemxFu%2FmPcTNHTx8D7L9nNUVIECkvxkhOZpbouecPBthgwzqoaTTZTVuFe0pU8FARaKQxtxKXba%2BGhPr48jWFZB85DBJ1xakRmBa7tuyYQ%2FzYyjzqRoe3u&ddkey=https%3AInvalidCookie
VR1 = REG1117: LDO Regulator Pos 1.25V to 13.5V 0.8A 4-Pin_3+Tab_ SOT-223 Tube; MF: Texas Instruments; Digi-Key_Part_Number: REG1117-ND; SnapEDA_Link: https://www.snapeda.com/parts/REG1117/Texas%20Instruments/view-part/?ref=snap; Package: SOT-223-4 Texas Instruments; Digi-Key_Purchase_URL: https://www.digikey.co.uk/product-detail/en/texas-instruments/REG1117/REG1117-ND/251211?utm_source=snapeda&utm_medium=aggregator&utm_campaign=symbol; MP: REG1117; Value: *; Buying URL:: https://uk.farnell.com/texas-instruments/reg1117-3-3/ic-v-reg-ldo-0-8a-3-3v-smd-1117/dp/1212355
X3 = Component_1: mf: ABM8G-30.000MHZ-18-D2Y-T; mf Company: ABM8G; Buying URL:: https://uk.rs-online.com/web/p/crystal-units/9047562/

## Sheet [05]-USB_C_MUX_Interface.SchDoc
size A4
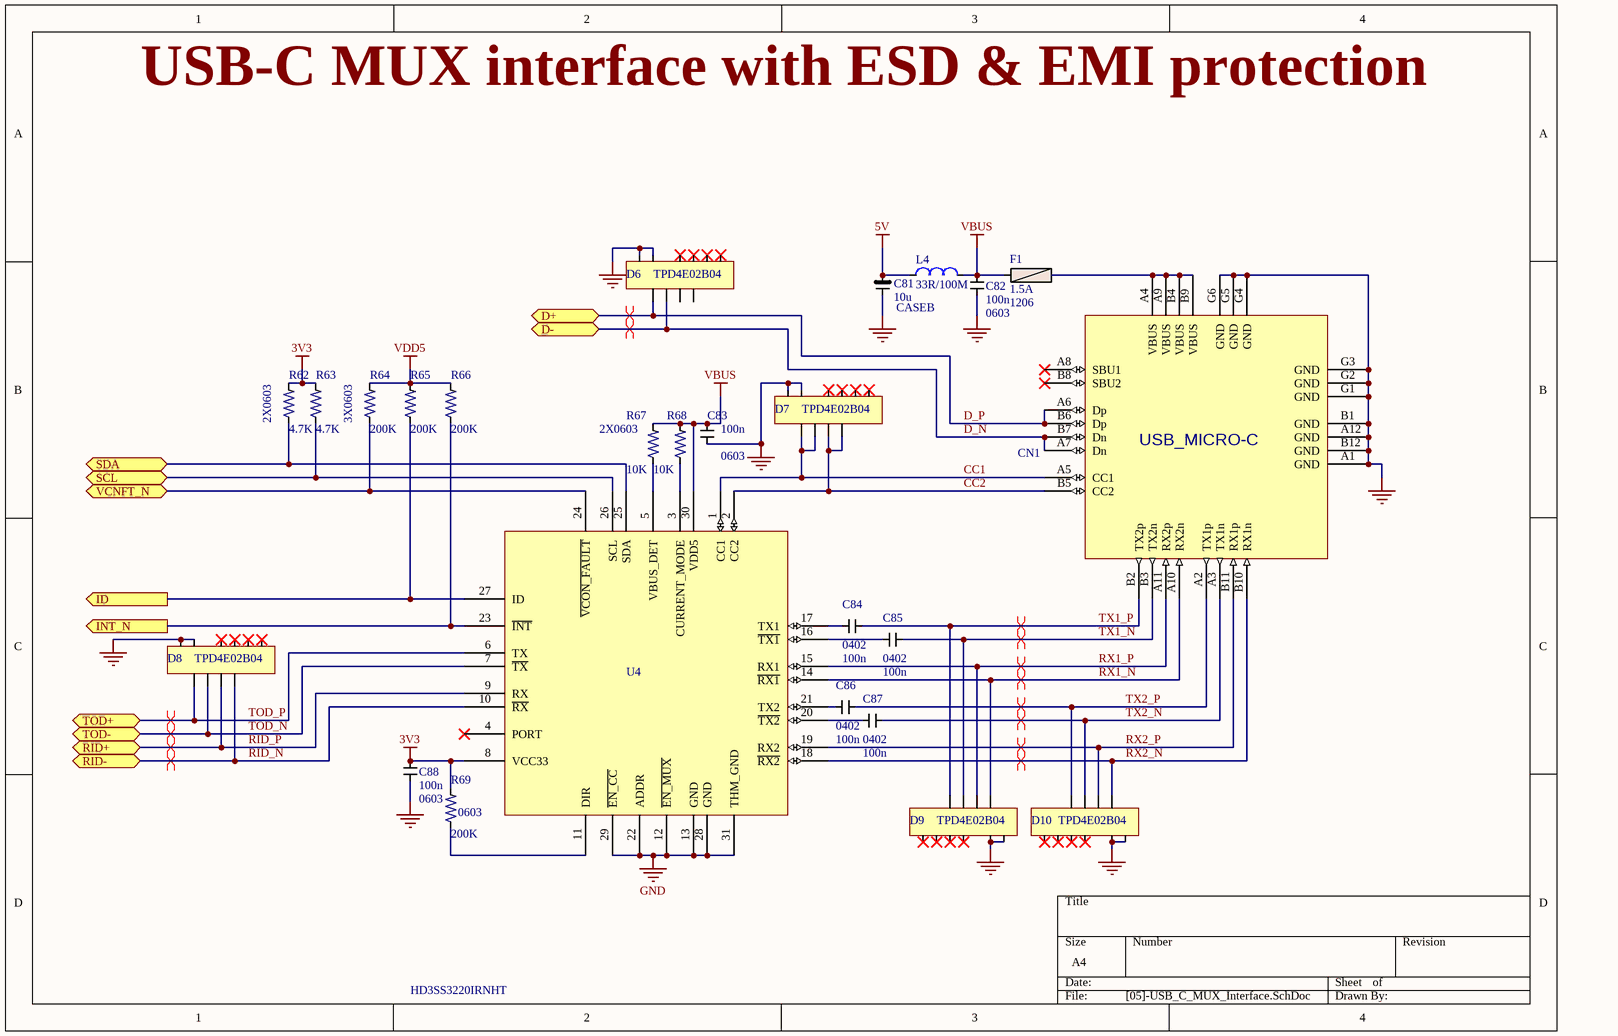
[diagram p4: [05]-USB_C_MUX_Interface.SchDoc]

### Parts
C81  10u  PCB layer: CASEB  [CAPC3528X21N]
C82  100n  PCB footprint: 0603
C83  100n  PCB footprint: 0603
C84  100n  PCB Stake: 0402  [*CAPC1005X60N]
C85  100n  PCB Stake: 0402  [*CAPC1005X60N]
C86  100n  PCB Stake: 0402  [*CAPC1005X60N]
C87  100n  PCB Stake: 0402  [*CAPC1005X60N]
C88  100n  PCB footprint: 0603
CN1  USB_MICRO-C  [PCBComponent_1 - duplicate1]
D6  TPD4E02B04
D7  TPD4E02B04
D8  TPD4E02B04  [TI_TPD4E05U06DQAR]
D9  TPD4E02B04  [TI_TPD4E05U06DQAR]
D10  TPD4E02B04  [TI_TPD4E05U06DQAR]
F1  1.5A  PCB type: 1206  [*CAP3216X125N]
L4  33R/100M  [*FB_BLM18PG121SN1D]
R62  4.7K  foot print: 2X0603  [*RESC1608X50N]
R63  4.7K  [*RESC1608X50N]
R64  200K  foot print: 3X0603  [*RESC1608X60N]
R65  200K  [*RESC1608X60N]
R66  200K  [*RESC1608X60N]
R67  10K  foot print: 2X0603  [*0603]
R68  10K  [*0603]
R69  200K  foot print: 0603  [*RESC1608X60N]
U4  HD3SS3220IRNHT  [QFN40P450X250X80-31N120X320]

### Ports
D+ (bidir), D- (bidir), ID (out), INT_N (out), RID+ (bidir), RID- (bidir), SCL (bidir), SDA (bidir), TOD+ (bidir), TOD- (bidir), VCNFT_N (bidir)

### Nets
3V3: C88.2 R62.2 R63.2 R69.2 U4.8(VCC33)
5V: C81.1 L4.1
GND: C81.2 C82.1 C83.1 C88.1 CN1.A1(GND) CN1.A12(GND) CN1.B1(GND) CN1.B12(GND) CN1.G1(GND) CN1.G2(GND) CN1.G3(GND) CN1.G4(GND) CN1.G5(GND) CN1.G6(GND) D6.3(GND) D6.8(GND) D7.3(GND) D7.8(GND) D8.3(GND) D8.8(GND) D9.3(GND) D9.8(GND) D10.3(GND) D10.8(GND) U4.12(~{EN_MUX}) U4.13(GND) U4.22(ADDR) U4.28(GND) U4.29(~{EN_CC}) U4.31(THM_GND)
VBUS: C82.2 C83.2 F1.1 L4.2 R67.2 R68.2 U4.30(VDD5)
VDD5: R64.2 R65.2 R66.2
CC1: CN1.A5(CC1) D7.1(IO1) D7.2(IO2) U4.1(CC1)
CC2: CN1.B5(CC2) D7.4(IO3) D7.5(IO4) U4.2(CC2)
D_N: CN1.A7(Dn) CN1.B7(Dn) D6.2(IO2) ; port D-
D_P: CN1.A6(Dp) CN1.B6(Dp) D6.1(IO1) ; port D+
RID_N: D8.5(IO4) U4.10(~{RX}) ; port RID-
RID_P: D8.4(IO3) U4.9(RX) ; port RID+
RX1_N: CN1.A10(RX2n) D9.1(IO1) U4.14(~{RX1})
RX1_P: CN1.A11(RX2p) D9.2(IO2) U4.15(RX1)
RX2_N: CN1.B10(RX1n) D10.1(IO1) U4.18(~{RX2})
RX2_P: CN1.B11(RX1p) D10.2(IO2) U4.19(RX2)
TOD_N: D8.2(IO2) U4.7(~{TX}) ; port TOD-
TOD_P: D8.1(IO1) U4.6(TX) ; port TOD+
TX1_N: C85.1 CN1.B3(TX2n) D9.4(IO3)
TX1_P: C84.1 CN1.B2(TX2p) D9.5(IO4)
TX2_N: C87.1 CN1.A3(TX1n) D10.4(IO3)
TX2_P: C86.1 CN1.A2(TX1p) D10.5(IO4)
NetC84_2: C84.2 U4.17(TX1)
NetC85_2: C85.2 U4.16(~{TX1})
NetC86_2: C86.2 U4.21(TX2)
NetC87_2: C87.2 U4.20(~{TX2})
NetCN1_A4: CN1.A4(VBUS) CN1.A9(VBUS) CN1.B4(VBUS) CN1.B9(VBUS) F1.2
NetR62_1: R62.1 U4.25(SDA) ; port SDA
NetR63_1: R63.1 U4.26(SCL) ; port SCL
NetR64_1: R64.1 U4.24(~{VCON_FAULT}) ; port VCNFT_N
NetR65_1: R65.1 U4.27(ID) ; port ID
NetR66_1: R66.1 U4.23(~{INT}) ; port INT_N
NetR67_1: R67.1 U4.5(VBUS_DET)
NetR68_1: R68.1 U4.3(CURRENT_MODE)
NetR69_1: R69.1 U4.11(DIR)

Not connected (* = marked no-connect by the designer): CN1 A8(SBU1)* B8(SBU2)*; D6 4(IO3) 5(IO4) 6(NC)* 7(NC)* 9(NC)* 10(NC)*; D7 6(NC)* 7(NC)* 9(NC)* 10(NC)*; D8 6(NC)* 7(NC)* 9(NC)* 10(NC)*; D9 6(NC)* 7(NC)* 9(NC)* 10(NC)*; D10 6(NC)* 7(NC)* 9(NC)* 10(NC)*; U4 4(PORT)*

### Layout directives
differential pair: D_N, D_P, RID_N, RID_P, RX1_N, RX1_P, RX2_N, RX2_P, TOD_N, TOD_P, TX1_N, TX1_P, TX2_N, TX2_P

### Notes on the sheet
- USB-C MUX interface with ESD & EMI protection

### Library data of the parts
C81-C88 D6 D7 F1 L4 = Component_1
  C82 C83 C88: Buying URL:: https://uk.farnell.com/avx/06031c104kat2a/cap-0-1-f-100v-10-x7r-0603/dp/2749806?st=100nf
  C84-C87: Buying URL:: https://uk.farnell.com/avx/04023c104kat2a/cap-0-1-f-25v-10-x7r-0402/dp/1867948RL
  F1: Buying URL:: https://uk.farnell.com/murata/blm31pg601sn1l/ferrite-bead-600r-1-5a-1206/dp/2672840
  L4: Buying URL:: https://uk.farnell.com/murata/blm18pg330sn1d/ferrite-bead-0-025ohm-3a-0603/dp/1515742?st=Ferrite%2033R/100MHz,%2025%25,%203A,%2025mR,%200603
CN1 = 1-2295018-2: Connector USB Type C RCP SMD 24 Terminal workable with USB 3.1,3.0 and 2.0 standards.; PCB Package type: smd USB type C connector; MF: TE Connectivity; Designed by: Faheem Minhas; Company: PhasePhotonics; 3D Model: NA; MP: 1-2295018-2; TE_purchase_URL: https://www.te.com/usa-en/product-1-2295018-2.html?te_bu=Cor&te_type=disp&te_campaign=seda_glo_cor-seda-global-disp-prtnr-fy19-seda-model-bom-cta_sma-317_1&elqCampaignId=32493; PCB footprint URL:: https://www.snapeda.com/parts/1-2295018-2/TE%20Connectivity%20AMP%20Connectors/view-part/?ref=snap; Price: 4.29 pound; Buying URL:: https://uk.farnell.com/te-connectivity/1-2295018-2/usb-connector-3-1-type-c-rcpt/dp/2568946?st=USB%20TYPE%20C; Datasheet URL:: http://www.farnell.com/datasheets/2292385.pdf?_ga=2.46605921.752270131.1548443175-886242363.1545409715&_gac=1.159200584.1547824021.Cj0KCQiAj4biBRC-ARIsAA4WaFgEVxY1DDQMjPmwclte-08yP6TbUPRUf-iJ2mTW08_wstvQJToLRRUaArGKEALw_wcB; Date created: 30/01/2019; Last modified: 30/01/2019
D8-D10 = Component_1: mf no.: TPD4E02B04DQAR; Company: TEXES INSTRUMENTS; Package Type: DQAR
R62 R64 R67 R69 = RP73D1J76R8BTDG: as R1 on sheet [03]-Python_Camera_Interface; Price: None; MP: RP73D1J76R8BTDG; Package: 0603 TE Connectivity / AMP; SnapEDA_Link: https://www.snapeda.com/parts/RP73D1J76R8BTDG/TE%20Connectivity%20/%20Holsworthy/view-part/?ref=snap; Value: *; Availability: Unavailable
  R62: Buying URL:: https://uk.farnell.com/te-connectivity/crgh0603f4k7/res-4k7-1-0-2w-0603-thick-film/dp/2332011?st=4.7K%200603
  R64 R69: Buying URL:: https://uk.farnell.com/vishay/crcw0603200kfkea/res-200k-1-0-1w-0603-thick-film/dp/1469776?st=200k%200603%20resistir
  R67: Buying URL:: https://uk.farnell.com/vishay/crcw060310k0fkea/res-10k-1-0-1w-0603-thick-film/dp/1469748?st=CRCW060310K0FKEA
R63 R65 R66 = RP73D1J76R8BTDG: as R4 on sheet [03]-Python_Camera_Interface; Price: None; MP: RP73D1J76R8BTDG; Package: 0603 TE Connectivity / AMP; SnapEDA_Link: https://www.snapeda.com/parts/RP73D1J76R8BTDG/TE%20Connectivity%20/%20Holsworthy/view-part/?ref=snap; Value: *; Availability: Unavailable
  R63: Buying URL:: https://uk.farnell.com/te-connectivity/crgh0603f4k7/res-4k7-1-0-2w-0603-thick-film/dp/2332011?st=4.7K%200603
  R65 R66: Buying URL:: https://uk.farnell.com/vishay/crcw0603200kfkea/res-200k-1-0-1w-0603-thick-film/dp/1469776?st=200k%200603%20resistir
R68 = RP73D1J76R8BTDG: Res Thin Film 0603 76.8 Ohm 0.1% 1/10W Â±15ppm/Â°C Molded SMD Paper T/R; MF: TE Connectivity / Holsworthy; Design by: Faheem; foot print: 2X0603; Price: None; MP: RP73D1J76R8BTDG; Package: 0603 TE Connectivity / AMP; SnapEDA_Link: https://www.snapeda.com/parts/RP73D1J76R8BTDG/TE%20Connectivity%20/%20Holsworthy/view-part/?ref=snap; Value: *; Buying URL:: https://uk.farnell.com/vishay/crcw060310k0fkea/res-10k-1-0-1w-0603-thick-film/dp/1469748?st=CRCW060310K0FKEA; Availability: Unavailable
U4 = HD3SS3220IRNHT: Super Speed Type-C DRP Port Controller USB 3.1 3.3V/5V T/R 30-Pin WQFN EP; MF: Texas Instruments; Availability: Unavailable; Package: WQFN-30 Texas Instruments; MP: HD3SS3220IRNHT; Price: None; SnapEDA_Link: https://www.snapeda.com/parts/HD3SS3220IRNHT/Texas%20Instruments/view-part/?ref=snap; Value: *

## Sheet [06]-DDR2_Interface.SchDoc
size A4
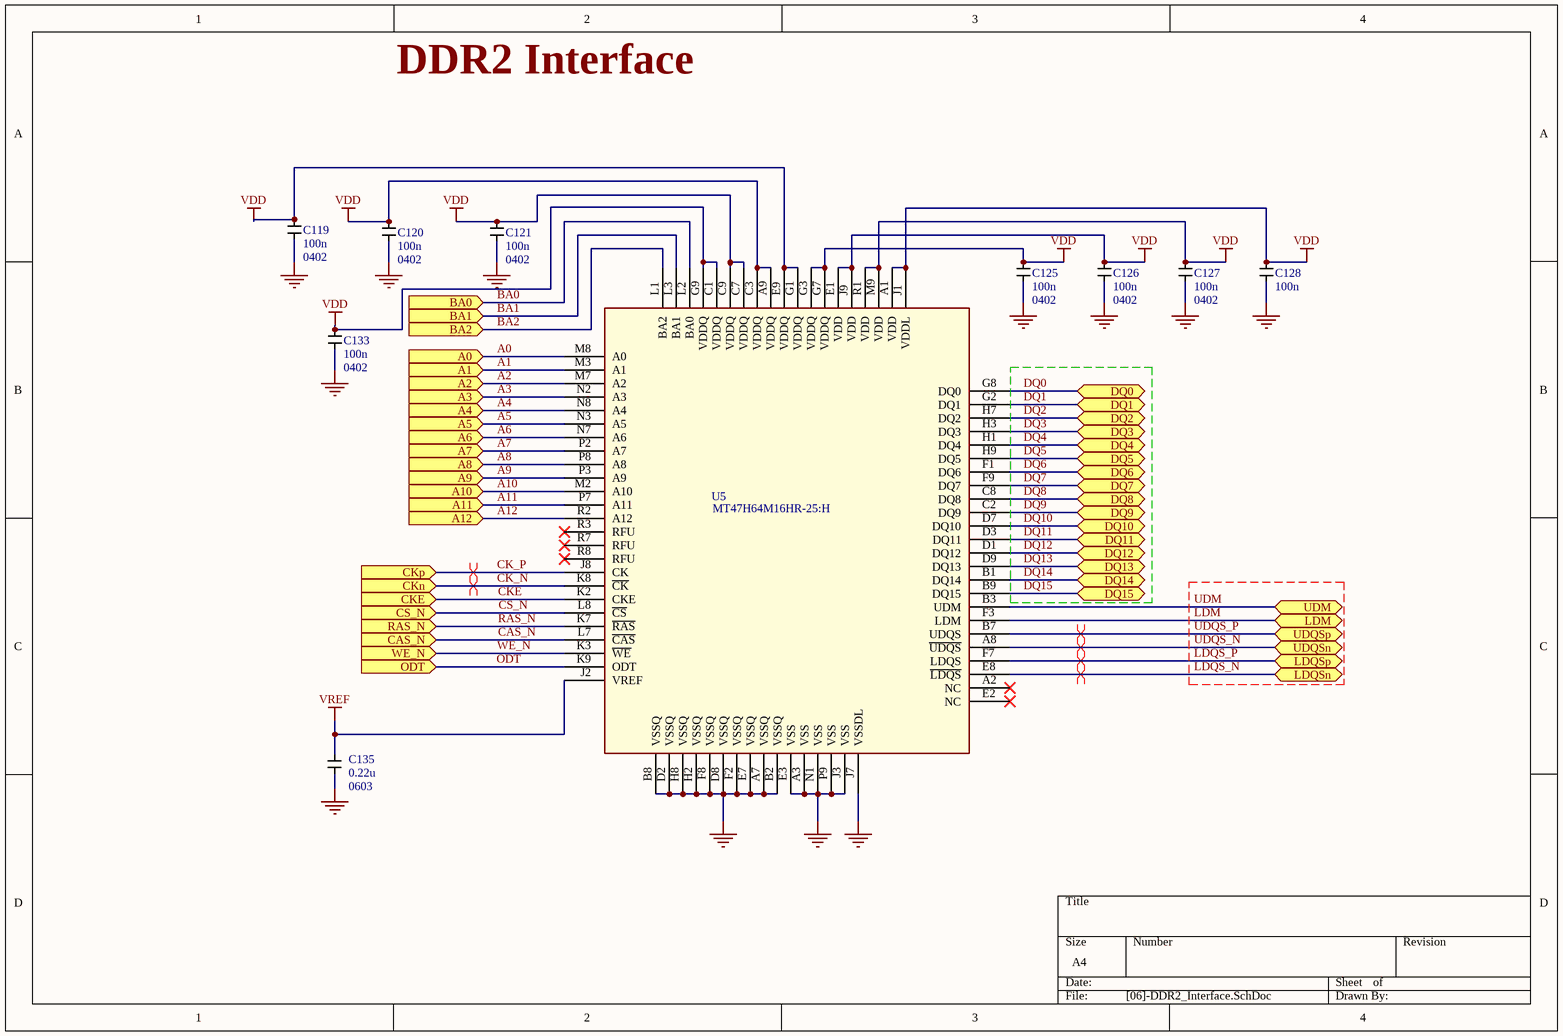
[diagram p5: [06]-DDR2_Interface.SchDoc]

### Parts
C119  100n  PCB Stake: 0402  [*CAPC1005X60N]
C120  100n  PCB Stake: 0402  [*CAPC1005X60N]
C121  100n  PCB Stake: 0402  [*CAPC1005X60N]
C125  100n  PCB Stake: 0402  [*CAPC1005X60N]
C126  100n  PCB Stake: 0402  [*CAPC1005X60N]
C127  100n  PCB Stake: 0402  [*CAPC1005X60N]
C128  100n  [*CAPC1005X60N]
C133  100n  PCB Stake: 0402  [*CAPC1005X60N]
C135  0.22u  PCB Layer:: 0603  [*0603]
U5  MT47H64M16HR-25:H  [BGA84CP80_15X9_1250X900X120B45N]

### Ports
A0 (in), A1 (in), A2 (in), A3 (in), A4 (in), A5 (in), A6 (in), A7 (in), A8 (in), A9 (in), A10 (in), A11 (in), A12 (in), BA0 (in), BA1 (in), BA2 (in), CAS_N (in), CKE (in), CKn (in), CKp (in), CS_N (in), DQ0, DQ1, DQ2, DQ3, DQ4, DQ5, DQ6, DQ7, DQ8, DQ9, DQ10, DQ11, DQ12, DQ13, DQ14, DQ15, LDM (bidir), LDQSn (bidir), LDQSp (bidir), ODT (in), RAS_N (in), UDM, UDQSn (bidir), UDQSp (bidir), WE_N (in)

### Nets
GND: C119.2 C120.2 C121.2 C125.2 C126.2 C127.2 C128.2 C133.2 C135.1 U5.A3(VSS) U5.A7(VSSQ) U5.B2(VSSQ) U5.B8(VSSQ) U5.D2(VSSQ) U5.D8(VSSQ) U5.E3(VSS) U5.E7(VSSQ) U5.F2(VSSQ) U5.F8(VSSQ) U5.H2(VSSQ) U5.H8(VSSQ) U5.J3(VSS) U5.J7(VSSDL) U5.N1(VSS) U5.P9(VSS)
VDD: C119.1 C120.1 C121.1 C125.1 C126.1 C127.1 C128.1 C133.1 U5.A1(VDD) U5.A9(VDDQ) U5.C1(VDDQ) U5.C3(VDDQ) U5.C7(VDDQ) U5.C9(VDDQ) U5.E1(VDD) U5.E9(VDDQ) U5.G1(VDDQ) U5.G3(VDDQ) U5.G7(VDDQ) U5.G9(VDDQ) U5.J1(VDDL) U5.J9(VDD) U5.M9(VDD) U5.R1(VDD)
VREF: C135.2 U5.J2(VREF)
A0: U5.M8(A0) ; port A0
A1: U5.M3(A1) ; port A1
A2: U5.M7(A2) ; port A2
A3: U5.N2(A3) ; port A3
A4: U5.N8(A4) ; port A4
A5: U5.N3(A5) ; port A5
A6: U5.N7(A6) ; port A6
A7: U5.P2(A7) ; port A7
A8: U5.P8(A8) ; port A8
A9: U5.P3(A9) ; port A9
A10: U5.M2(A10) ; port A10
A11: U5.P7(A11) ; port A11
A12: U5.R2(A12) ; port A12
BA0: U5.L2(BA0) ; port BA0
BA1: U5.L3(BA1) ; port BA1
BA2: U5.L1(BA2) ; port BA2
CAS_N: U5.L7(~{CAS}) ; port CAS_N
CK_N: U5.K8(~{CK}) ; port CKn
CK_P: U5.J8(CK) ; port CKp
CKE: U5.K2(CKE) ; port CKE
CS_N: U5.L8(~{CS}) ; port CS_N
DQ0: U5.G8(DQ0) ; port DQ0
DQ1: U5.G2(DQ1) ; port DQ1
DQ2: U5.H7(DQ2) ; port DQ2
DQ3: U5.H3(DQ3) ; port DQ3
DQ4: U5.H1(DQ4) ; port DQ4
DQ5: U5.H9(DQ5) ; port DQ5
DQ6: U5.F1(DQ6) ; port DQ6
DQ7: U5.F9(DQ7) ; port DQ7
DQ8: U5.C8(DQ8) ; port DQ8
DQ9: U5.C2(DQ9) ; port DQ9
DQ10: U5.D7(DQ10) ; port DQ10
DQ11: U5.D3(DQ11) ; port DQ11
DQ12: U5.D1(DQ12) ; port DQ12
DQ13: U5.D9(DQ13) ; port DQ13
DQ14: U5.B1(DQ14) ; port DQ14
DQ15: U5.B9(DQ15) ; port DQ15
LDM: U5.F3(LDM) ; port LDM
LDQS_N: U5.E8(~{LDQS}) ; port LDQSn
LDQS_P: U5.F7(LDQS) ; port LDQSp
ODT: U5.K9(ODT) ; port ODT
RAS_N: U5.K7(~{RAS}) ; port RAS_N
UDM: U5.B3(UDM) ; port UDM
UDQS_N: U5.A8(~{UDQS}) ; port UDQSn
UDQS_P: U5.B7(UDQS) ; port UDQSp
WE_N: U5.K3(~{WE}) ; port WE_N

Not connected (* = marked no-connect by the designer): U5 A2(NC)* E2(NC)* R3(RFU)* R7(RFU)* R8(RFU)*

### Layout directives
differential pair: CK_N, CK_P, LDQS_N, LDQS_P, UDQS_N, UDQS_P

### Notes on the sheet
- DDR2 Interface

### Library data of the parts
C119-C121 C125-C128 C133 C135 = Component_1
  C119-C121 C125-C128 C133: Buying URL:: https://uk.farnell.com/avx/04023c104kat2a/cap-0-1-f-25v-10-x7r-0402/dp/1867948RL
  C135: Buying URL:: https://uk.farnell.com/avx/0603yc105kat2a/cap-1-f-16v-10-x7r-0603/dp/1658870RL?st=1u%200603
U5 = micron_ddr2_sdram: DDR2 SDRAM with configuration of 64 Meg * 16 bits.; Designer: Faheem Minhas; Company: PhasePhotonics; 3D model: 3D contenental; PCB model: snapEDA; PCB package type: FBGA; Date Created: 18-Janruary-2019; Data Sheet URL: static6.arrow.com/aropdfconversion/e8a5cdd149c7439f33fcdfacad6c2c34fc62263c/mt47h64m16hr-25it.pdf; Byer URL: https://www.arrow.com/en/products/mt47h64m16hr-25h/micron-technology; Last Modified: 31/01/2019

## Sheet [07]-SDcard_Testpoints_Ext_SPI_Interface.SchDoc: SD card Test points and External SPI Interface
size A4; Date: 09/02/2019; Author: Faheem Minhas; Organization: PhasePhotonics; SheetNumber: 11; SheetTotal: 20
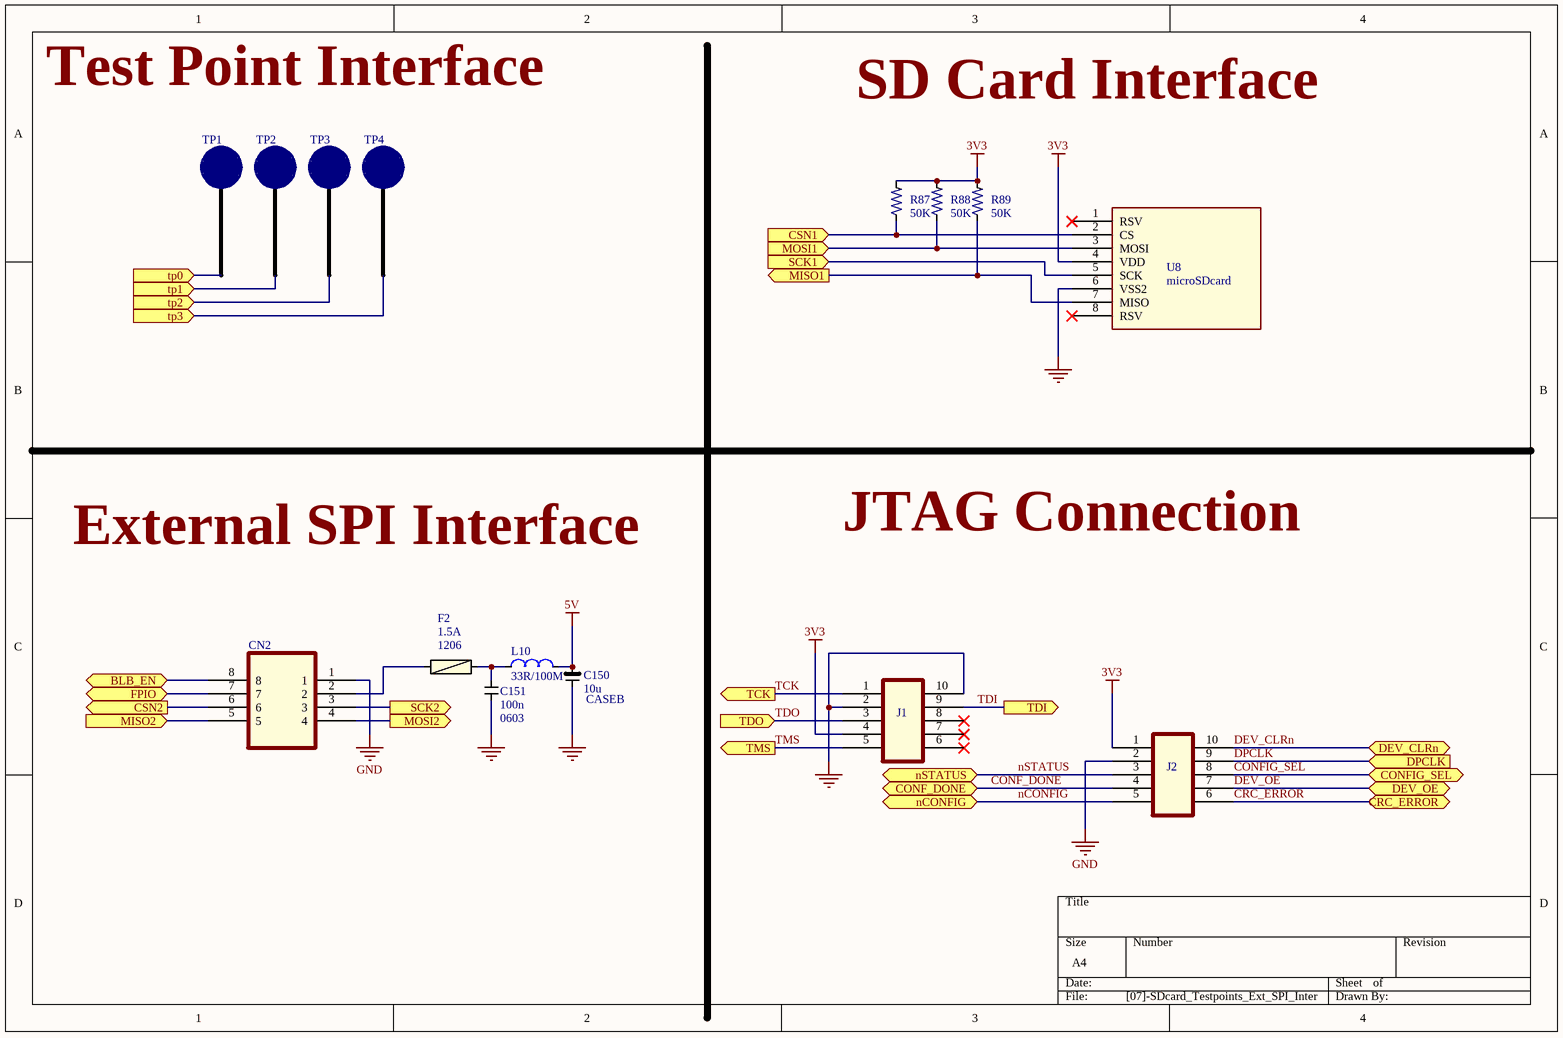
[diagram p6: [07]-SDcard_Testpoints_Ext_SPI_Interface.SchDoc]

### Parts
C150  10u  PCB layer: CASEB  [CAPC3528X21N]
C151  100n  PCB footprint: 0603
CN2  SPI_connector  [TE_7-215079-8_0]  (value not drawn)
F2  1.5A  PCB type: 1206  [*CAP3216X125N]
J1  1761681-3  [Harwin_Inc._M50-3500542_0]  (value not drawn)
J2  1761681-3  [Harwin_Inc._M50-3500542_0]  (value not drawn)
L10  33R/100M  [*FB_BLM18PG121SN1D]
R87  50K  [*RESC1608X60N]
R88  50K  [*RESC1608X60N]
R89  50K  [*RESC1608X60N]
TP1  TEST-7CN  [PCBComponent_1]  (value not drawn)
TP2  TEST-7CN  [PCBComponent_1]  (value not drawn)
TP3  TEST-7CN  [PCBComponent_1]  (value not drawn)
TP4  TEST-7CN  [PCBComponent_1]  (value not drawn)
U8  microSDcard  [*MOLEX_500901-0801_500901-0801(Primary)]

### Ports
BLB_EN (bidir), CONF_DONE (bidir), CONFIG_SEL (bidir), CRC_ERROR (bidir), CSN1 (in), CSN2 (out), DEV_CLRn (bidir), DEV_OE (bidir), DPCLK (in), FPIO (bidir), MISO1 (out), MISO2 (in), MOSI1 (in), MOSI2 (out), nCONFIG (bidir), nSTATUS (bidir), SCK1 (in), SCK2 (out), TCK (out), TDI (out), TDO (in), TMS (out), tp0 (in), tp1 (in), tp2 (in), tp3 (in)

### Nets
3V3: J1.4 J2.1 R87.2 R88.2 R89.2 U8.4(VDD)
5V: C150.1 L10.2
GND: C150.2 C151.1 CN2.1 J1.2 J1.10 J2.2 U8.6(VSS2)
CONF_DONE: J2.4 ; port CONF_DONE
CONFIG_SEL: J2.8 ; port CONFIG_SEL
CRC_ERROR: J2.6 ; port CRC_ERROR
DEV_CLRn: J2.10 ; port DEV_CLRn
DEV_OE: J2.7 ; port DEV_OE
DPCLK: J2.9 ; port DPCLK
nCONFIG: J2.5 ; port nCONFIG
nSTATUS: J2.3 ; port nSTATUS
TCK: J1.1 ; port TCK
TDI: J1.9 ; port TDI
TDO: J1.3 ; port TDO
TMS: J1.5 ; port TMS
NetC151_2: C151.2 L10.1
NetCN2_2: CN2.2 F2.1
NetCN2_3: CN2.3 ; port SCK2
NetCN2_4: CN2.4 ; port MOSI2
NetCN2_5: CN2.5 ; port MISO2
NetCN2_6: CN2.6 ; port CSN2
NetCN2_7: CN2.7 ; port FPIO
NetCN2_8: CN2.8 ; port BLB_EN
NetR87_1: R87.1 U8.2(CS) ; port CSN1
NetR88_1: R88.1 U8.3(MOSI) ; port MOSI1
NetR89_1: R89.1 U8.7(MISO) ; port MISO1
NetTP1_1: TP1.1 ; port tp0
NetTP2_1: TP2.1 ; port tp1
NetTP3_1: TP3.1 ; port tp2
NetTP4_1: TP4.1 ; port tp3
NetU3_D6: U8.5(SCK) ; port SCK1

Not connected (* = marked no-connect by the designer): F2 2; J1 6* 7* 8*; U8 1(RSV)* 8(RSV)*

### Notes on the sheet
- Test Point Interface
- SD Card Interface
- External SPI Interface
- JTAG Connection

### Library data of the parts
C150 C151 F2 L10 TP1-TP4 = Component_1
  C151: Buying URL:: https://uk.farnell.com/avx/06031c104kat2a/cap-0-1-f-100v-10-x7r-0603/dp/2749806?st=100nf
  F2: Buying URL:: https://uk.farnell.com/murata/blm31pg601sn1l/ferrite-bead-600r-1-5a-1206/dp/2672840
  L10: Buying URL:: https://uk.farnell.com/murata/blm18pg330sn1d/ferrite-bead-0-025ohm-3a-0603/dp/1515742?st=Ferrite%2033R/100MHz,%2025%25,%203A,%2025mR,%200603
  TP1-TP4: Buying URL:: https://www.toby.co.uk/pcb-hardware/test-points-and-pins/test-7cn-valcon-ceramic-body-loop-pcb-test-points/
CN2 = Conn_TE_7-215079-8_eec: CONN FMALE-ON-BRD 8POS VERT T/H; Buying URL:: https://uk.farnell.com/amp-te-connectivity/7-215079-8/receptacle-idc-1-27mm-8way/dp/148593
J1 J2 = 1761681-3: IDC LOW PRO HDR 10P VERT HT BLACK; MF: hARWIN; MP: M50-3500542
R87-R89 = RP73D1J76R8BTDG: Res Thin Film 0603 76.8 Ohm 0.1% 1/10W Â±15ppm/Â°C Molded SMD Paper T/R; MF: TE Connectivity / Holsworthy; Design by: Faheem; foot print: 3X0603; Price: None; MP: RP73D1J76R8BTDG; Package: 0603 TE Connectivity / AMP; SnapEDA_Link: https://www.snapeda.com/parts/RP73D1J76R8BTDG/TE%20Connectivity%20/%20Holsworthy/view-part/?ref=snap; Value: *; Buying URL:: https://uk.farnell.com/vishay/crcw0603200kfkea/res-200k-1-0-1w-0603-thick-film/dp/1469776?st=200k%200603%20resistir; Availability: Unavailable
U8 = 500901-0801: Conn.; IC Socket; Memory Card; 1.10mm Pitch; TransFlash; Hinge Type; Round Corner Top; MF: Molex; Availability: Unavailable; Package: None; Price: None; SnapEDA_Link: https://www.snapeda.com/parts/500901-0801/Molex/view-part/?ref=snap; MP: 500901-0801; Value: *; Buying URL:: https://uk.farnell.com/molex/500901-0801/connector-micro-sd-8pos/dp/1344008?st=500901-0801

## Sheet [08]-FPGA_Bank_1_Interface.SchDoc
size A4
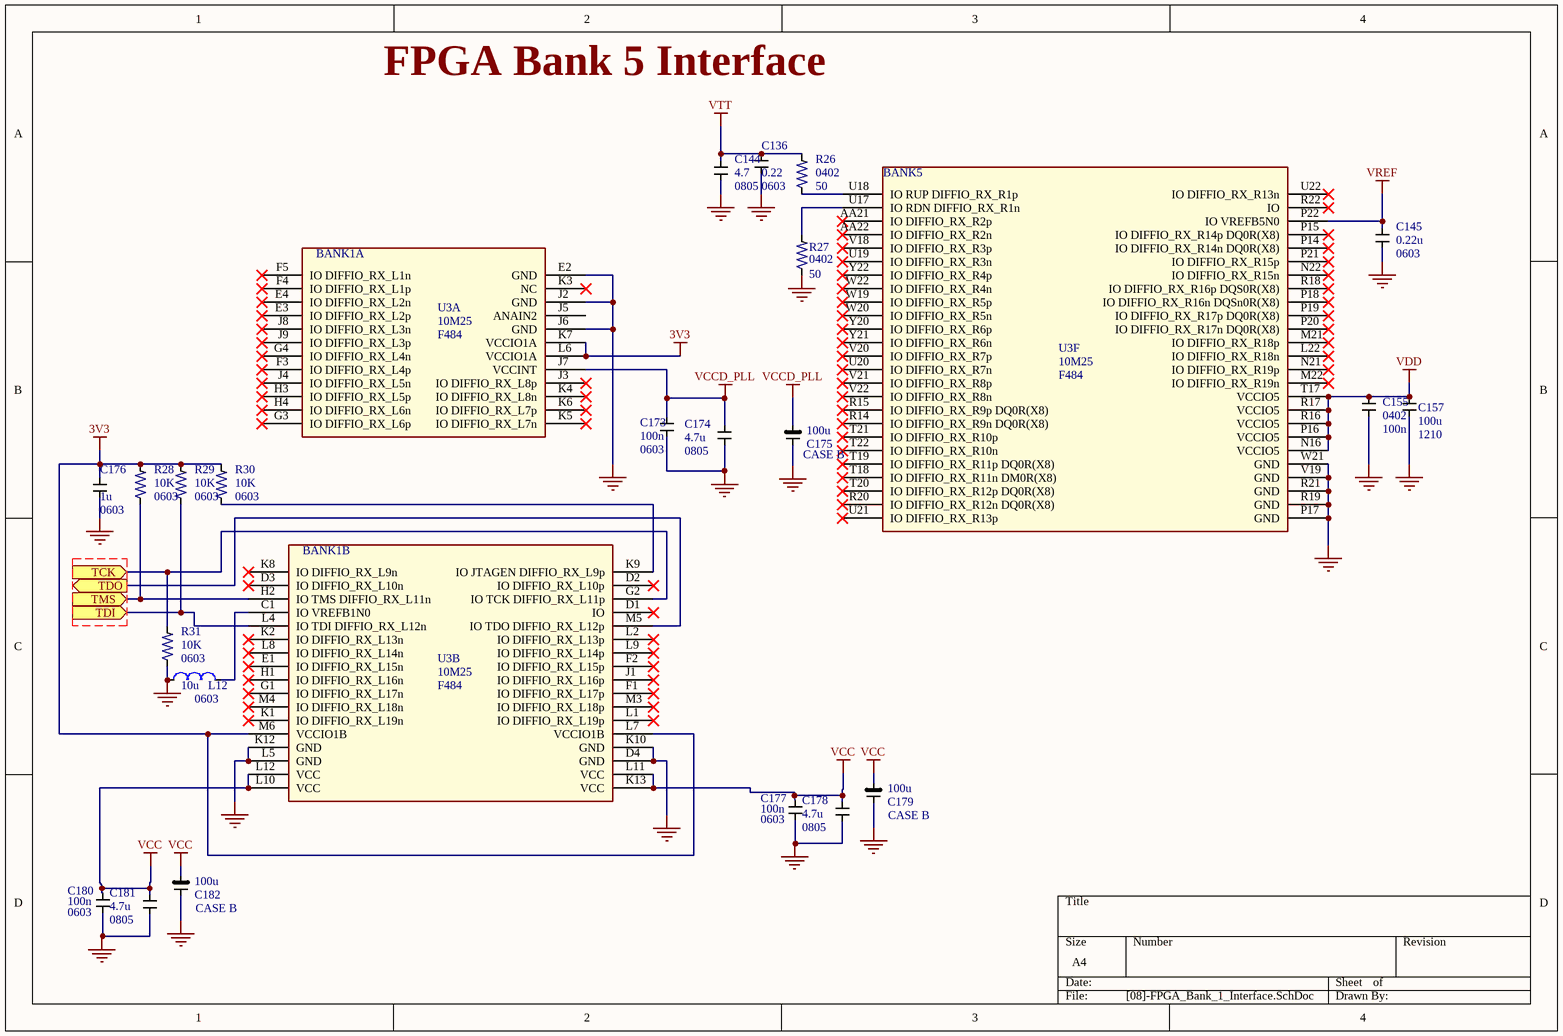
[diagram p7: [08]-FPGA_Bank_1_Interface.SchDoc]

### Parts
C136  0.22  PCB Layer:: 0603  [*0603]
C144  4.7  PCB Package: 0805  [*CAPC2013X140N]
C145  0.22u  PCB Layer:: 0603  [*0603]
C155  100n
C157  100u  PCB package type: 1210  [CAPC3225X28N]
C173  100n  PCB Layer:: 0603  [*0603]
C174  4.7u  PCB footprint: 0805
C175  100u  CASE: CASE B  [CAPC3529X21N]
C176  1u  PCB Layer:: 0603  [*0603]
C177  100n  PCB Layer:: 0603  [*0603]
C178  4.7u  PCB footprint: 0805
C179  100u  CASE: CASE B  [CAPC3529X21N]
C180  100n  PCB Layer:: 0603  [*0603]
C181  4.7u  PCB footprint: 0805
C182  100u  CASE: CASE B  [CAPC3529X21N]
L12  10u  PCB Layout:: 0603  [*INDC1608X95N]
R26  50  PCB footprint: 0402  [*R0402]
R27  50  PCB footprint: 0402  [*R0402]
R28  10K  foot print: 0603  [*0603]
R29  10K  foot print: 0603  [*0603]
R30  10K  foot print: 0603  [*0603]
R31  10K  foot print: 0603  [*0603]
U3  10M25  Package Type: F484  [*BGA484C100P22X22_2300X2300X200N]  (parts A,B,F of 9)

### Ports
TCK (in), TDI (in), TDO (out), TMS (in)

### Nets
3V3: C176.2 R28.2 R29.2 R30.2 U3.K7(VCCIO1A) U3.L6(VCCIO1A) U3.L7(VCCIO1B) U3.M6(VCCIO1B)
GND: C136.1 C144.1 C145.1 C155.1 C157.1 C173.1 C174.1 C175.2 C176.1 C177.1 C178.1 C179.2 C180.1 C181.1 C182.2 L12.1 R27.1 R31.1 U3.D4(GND) U3.E2(GND) U3.J2(GND) U3.J6(GND) U3.K10(GND) U3.K12(GND) U3.L5(GND) U3.P17(GND) U3.R19(GND) U3.R21(GND) U3.V19(GND) U3.W21(GND)
VCC: C177.2 C178.2 C179.1 C180.2 C181.2 C182.1 U3.K13(VCC) U3.L10(VCC) U3.L11(VCC) U3.L12(VCC)
VCCD_PLL: C173.2 C174.2 C175.1 U3.J7(VCCINT)
VDD: C155.2 C157.2 U3.N16(VCCIO5) U3.P16(VCCIO5) U3.R16(VCCIO5) U3.R17(VCCIO5) U3.T17(VCCIO5)
VREF: C145.2 U3.P22(IO_VREFB5N0)
VTT: C136.2 C144.2 R26.2
TCK: R31.2 U3.G2(IO_TCK_DIFFIO_RX_L11p) ; port TCK
TDI: R29.1 U3.L4(IO_TDI_DIFFIO_RX_L12n) ; port TDI
TDO: U3.M5(IO_TDO_DIFFIO_RX_L12p) ; port TDO
TMS: R28.1 U3.H2(IO_TMS_DIFFIO_RX_L11n) ; port TMS
NetL12_2: L12.2 U3.C1(IO_VREFB1N0)
NetR26_1: R26.1 U3.U18(IO_RUP_DIFFIO_RX_R1p)
NetR27_2: R27.2 U3.U17(IO_RDN_DIFFIO_RX_R1n)
NetR30_1: R30.1 U3.K9(IO_JTAGEN_DIFFIO_RX_L9p)

Not connected (* = marked no-connect by the designer): U3 AA21(IO_DIFFIO_RX_R2p)* AA22(IO_DIFFIO_RX_R2n)* D1(IO)* D2(IO_DIFFIO_RX_L10p)* D3(IO_DIFFIO_RX_L10n)* E1(IO_DIFFIO_RX_L15n)* E3(IO_DIFFIO_RX_L2p)* E4(IO_DIFFIO_RX_L2n)* F1(IO_DIFFIO_RX_L17p)* F2(IO_DIFFIO_RX_L15p)* F3(IO_DIFFIO_RX_L4p)* F4(IO_DIFFIO_RX_L1p)* F5(IO_DIFFIO_RX_L1n)* G1(IO_DIFFIO_RX_L17n)* G3(IO_DIFFIO_RX_L6p)* G4(IO_DIFFIO_RX_L4n)* H1(IO_DIFFIO_RX_L16n)* H3(IO_DIFFIO_RX_L5p)* H4(IO_DIFFIO_RX_L6n)* J1(IO_DIFFIO_RX_L16p)* J3(IO_DIFFIO_RX_L8p)* J4(IO_DIFFIO_RX_L5n)* J5(ANAIN2) J8(IO_DIFFIO_RX_L3n)* J9(IO_DIFFIO_RX_L3p)* K1(IO_DIFFIO_RX_L19n)* K2(IO_DIFFIO_RX_L13n)* K3(NC)* K4(IO_DIFFIO_RX_L8n)* K5(IO_DIFFIO_RX_L7n)* K6(IO_DIFFIO_RX_L7p)* K8(IO_DIFFIO_RX_L9n)* L1(IO_DIFFIO_RX_L19p)* L2(IO_DIFFIO_RX_L13p)* L8(IO_DIFFIO_RX_L14n)* L9(IO_DIFFIO_RX_L14p)* L22(IO_DIFFIO_RX_R18n)* M3(IO_DIFFIO_RX_L18p)* M4(IO_DIFFIO_RX_L18n)* M21(IO_DIFFIO_RX_R18p)* M22(IO_DIFFIO_RX_R19n)* N21(IO_DIFFIO_RX_R19p)* N22(IO_DIFFIO_RX_R15n)* P14(IO_DIFFIO_RX_R14n_DQ0R(X8))* P15(IO_DIFFIO_RX_R14p_DQ0R(X8))* P18(IO_DIFFIO_RX_R16n_DQSn0R(X8))* P19(IO_DIFFIO_RX_R17p_DQ0R(X8))* P20(IO_DIFFIO_RX_R17n_DQ0R(X8))* P21(IO_DIFFIO_RX_R15p)* R14(IO_DIFFIO_RX_R9n_DQ0R(X8))* R15(IO_DIFFIO_RX_R9p_DQ0R(X8))* R18(IO_DIFFIO_RX_R16p_DQS0R(X8))* R20(IO_DIFFIO_RX_R12n_DQ0R(X8))* R22(IO)* T18(IO_DIFFIO_RX_R11n_DM0R(X8))* T19(IO_DIFFIO_RX_R11p_DQ0R(X8))* T20(IO_DIFFIO_RX_R12p_DQ0R(X8))* T21(IO_DIFFIO_RX_R10p)* T22(IO_DIFFIO_RX_R10n)* U19(IO_DIFFIO_RX_R3n)* U20(IO_DIFFIO_RX_R7n)* U21(IO_DIFFIO_RX_R13p)* U22(IO_DIFFIO_RX_R13n)* V18(IO_DIFFIO_RX_R3p)* V20(IO_DIFFIO_RX_R7p)* V21(IO_DIFFIO_RX_R8p)* V22(IO_DIFFIO_RX_R8n)* W19(IO_DIFFIO_RX_R5p)* W20(IO_DIFFIO_RX_R5n)* W22(IO_DIFFIO_RX_R4n)* Y20(IO_DIFFIO_RX_R6p)* Y21(IO_DIFFIO_RX_R6n)* Y22(IO_DIFFIO_RX_R4p)*

### Notes on the sheet
- FPGA Bank 5 Interface
- (in symbol Component_1) 0402
- (in symbol Component_1, part A) BANK1A
- (in symbol Component_1, part B) BANK1B
- (in symbol Component_1, part F) BANK5

### Library data of the parts
C136 C144 C145 C155 C157 C173-C182 L12 = Component_1
  C136 C145 C173 C176 C177 C180: Buying URL:: https://uk.farnell.com/avx/0603yc105kat2a/cap-1-f-16v-10-x7r-0603/dp/1658870RL?st=1u%200603
  C144: Buying URL:: https://uk.farnell.com/avx/08053d475kat2a/cap-4-7-f-25v-10-x5r-0805/dp/1657932?st=4.7u%200805
  C155: Buying URL: https://uk.farnell.com/avx/04023c104kat2a/cap-0-1-f-25v-10-x7r-0402/dp/1867948?st=100n
  C174 C178 C181: Buying URL:: NEED TO BE ADDED
  C175 C179 C182: Buying URL:: https://uk.farnell.com/avx/tajb107k006tnj/cap-tant-aec-q200-100uf-6-3v-case/dp/2893386?st=100u%20CASE%20B
  L12: Buying URL:: https://uk.farnell.com/tdk/mlz1608m100wt/inductor-10uh-20-shielded/dp/2215635?st=10uH%200603
R26 R27 = RP73D1J76R8BTDG: as R2 on sheet [03]-Python_Camera_Interface; Buying URL:: https://uk.farnell.com/yageo/rc0402fr-07100rl/res-100r-1-0-0625w-0402-thick/dp/9239111
R28-R31 = RP73D1J76R8BTDG: as R1 on sheet [03]-Python_Camera_Interface; Price: None; MP: RP73D1J76R8BTDG; Package: 0603 TE Connectivity / AMP; SnapEDA_Link: https://www.snapeda.com/parts/RP73D1J76R8BTDG/TE%20Connectivity%20/%20Holsworthy/view-part/?ref=snap; Value: *; Buying URL:: https://uk.farnell.com/vishay/crcw060347k0fkea/res-47k-1-0-1w-0603-thick-film/dp/1469811?st=47K%200603; Availability: Unavailable
U3 = Component_1: Part no.: 10M25DAF484I7G

## Sheet [09]-FPGA_Bank_2_Interface.SchDoc
size A4
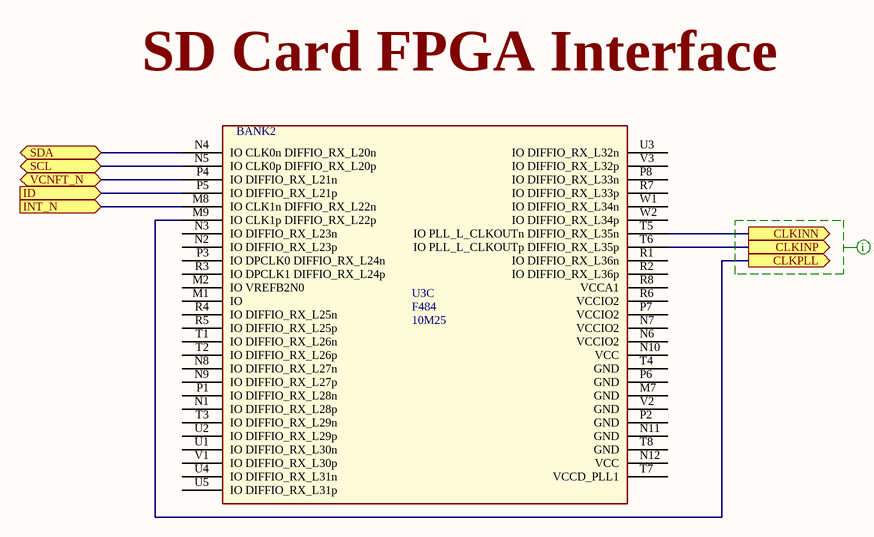
[diagram p8: [09]-FPGA_Bank_2_Interface.SchDoc]

### Parts
U3  10M25  Package Type: F484  [*BGA484C100P22X22_2300X2300X200N]  (part C of 9)

### Ports
CLKINN (out), CLKINP (out), CLKPLL (out), ID (in), INT_N (in), SCL (bidir), SDA (bidir), VCNFT_N (bidir)

### Nets
CLKIN_N: U3.T5(IO_PLL_L_CLKOUTn_DIFFIO_RX_L35n) ; port CLKINN
CLKIN_P: U3.T6(IO_PLL_L_CLKOUTp_DIFFIO_RX_L35p) ; port CLKINP
CLKPLL: U3.M9(IO_CLK1p_DIFFIO_RX_L22p) ; port CLKPLL
NetR62_1: U3.N4(IO_CLK0n_DIFFIO_RX_L20n) ; port SDA
NetR63_1: U3.N5(IO_CLK0p_DIFFIO_RX_L20p) ; port SCL
NetR64_1: U3.P4(IO_DIFFIO_RX_L21n) ; port VCNFT_N
NetR65_1: U3.P5(IO_DIFFIO_RX_L21p) ; port ID
NetR66_1: U3.M8(IO_CLK1n_DIFFIO_RX_L22n) ; port INT_N

Not connected (* = marked no-connect by the designer): U3 M1(IO) M2(IO_VREFB2N0) M7(GND) N1(IO_DIFFIO_RX_L28p) N2(IO_DIFFIO_RX_L23p) N3(IO_DIFFIO_RX_L23n) N6(VCCIO2) N7(VCCIO2) N8(IO_DIFFIO_RX_L27n) N9(IO_DIFFIO_RX_L27p) N10(VCC) N11(GND) N12(VCC) P1(IO_DIFFIO_RX_L28n) P2(GND) P3(IO_DPCLK0_DIFFIO_RX_L24n) P6(GND) P7(VCCIO2) P8(IO_DIFFIO_RX_L33n) R1(IO_DIFFIO_RX_L36n) R2(IO_DIFFIO_RX_L36p) R3(IO_DPCLK1_DIFFIO_RX_L24p) R4(IO_DIFFIO_RX_L25n) R5(IO_DIFFIO_RX_L25p) R6(VCCIO2) R7(IO_DIFFIO_RX_L33p) R8(VCCA1) T1(IO_DIFFIO_RX_L26n) T2(IO_DIFFIO_RX_L26p) T3(IO_DIFFIO_RX_L29n) T4(GND) T7(VCCD_PLL1) T8(GND) U1(IO_DIFFIO_RX_L30n) U2(IO_DIFFIO_RX_L29p) U3(IO_DIFFIO_RX_L32n) U4(IO_DIFFIO_RX_L31n) U5(IO_DIFFIO_RX_L31p) V1(IO_DIFFIO_RX_L30p) V2(GND) V3(IO_DIFFIO_RX_L32p) W1(IO_DIFFIO_RX_L34n) W2(IO_DIFFIO_RX_L34p)

### Layout directives
mark named Input Clocks: (no net found under the mark)

### Notes on the sheet
- SD Card FPGA Interface
- (in symbol Component_1, part C) BANK2

### Library data of the parts
U3 = Component_1: Part no.: 10M25DAF484I7G

## Sheet [10]-FPGA_Bank_3_Interface.SchDoc
size A4
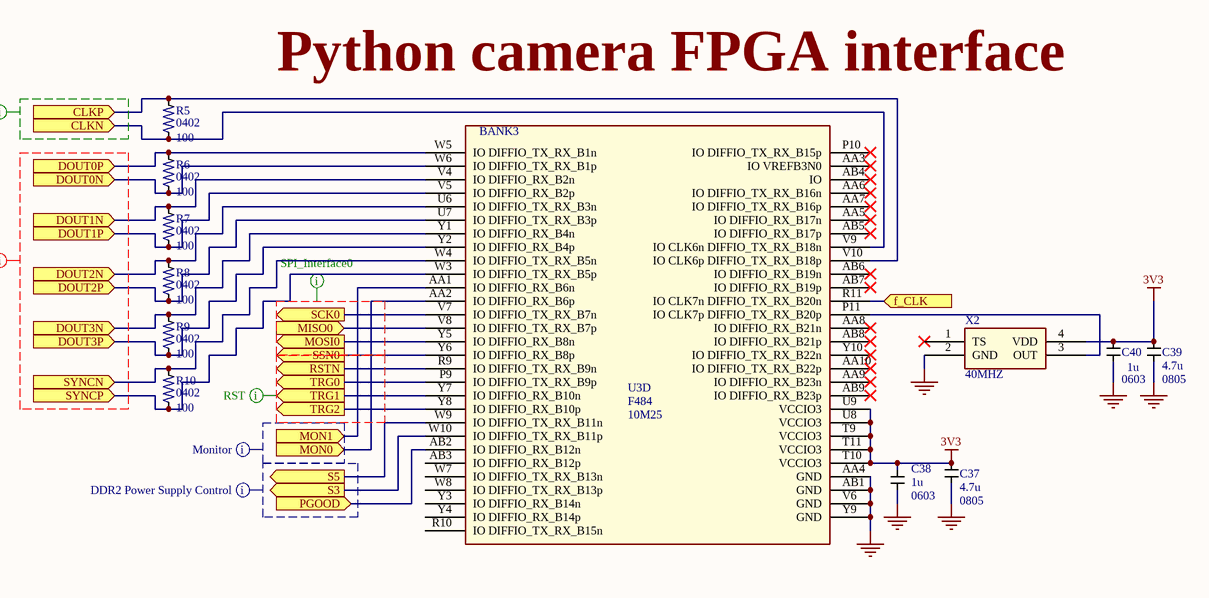
[diagram p9: [10]-FPGA_Bank_3_Interface.SchDoc]

### Parts
C37  4.7u  PCB Package: 0805  [*CAPC2013X140N]
C38  1u  PCB Layer:: 0603  [*0603]
C39  4.7u  PCB Package: 0805  [*CAPC2013X140N]
C40  1u  PCB Layer:: 0603  [*0603]
R5  100  PCB footprint: 0402  [*R0402]
R6  100  PCB footprint: 0402  [*R0402]
R7  100  PCB footprint: 0402  [*R0402]
R8  100  PCB footprint: 0402  [*R0402]
R9  100  PCB footprint: 0402  [*R0402]
R10  100  PCB footprint: 0402  [*R0402]
U3  10M25  Package Type: F484  [*BGA484C100P22X22_2300X2300X200N]  (part D of 9)
X2  40MHZ  [OSC_DSC6083CI2A-032K768]

### Ports
CLKN (in), CLKP (in), DOUT0N (in), DOUT0P (in), DOUT1N (in), DOUT1P (in), DOUT2N (in), DOUT2P (in), DOUT3N (in), DOUT3P (in), f_CLK (in), MISO0 (in), MON0 (in), MON1 (in), MOSI0 (out), PGOOD (in), RSTN (out), S3 (out), S5 (out), SCK0 (out), SSN0 (out), SYNCN (in), SYNCP (in), TRG0 (out), TRG1 (out), TRG2 (out)

### Nets
3V3: C37.2 C38.2 C39.2 C40.2 U3.T9(VCCIO3) U3.T10(VCCIO3) U3.T11(VCCIO3) U3.U8(VCCIO3) U3.U9(VCCIO3) X2.4(VDD)
GND: C37.1 C38.1 C39.1 C40.1 U3.AA4(GND) U3.AB1(GND) U3.V6(GND) U3.Y9(GND) X2.2(GND)
CLK: U3.R11(IO_CLK7n_DIFFIO_TX_RX_B20n) ; port f_CLK
CLK_N: R5.1 U3.V9(IO_CLK6n_DIFFIO_TX_RX_B18n) ; port CLKN
CLK_P: R5.2 U3.V10(IO_CLK6p_DIFFIO_TX_RX_B18p) ; port CLKP
DOUT0_N: R6.1 U3.W6(IO_DIFFIO_TX_RX_B1p) ; port DOUT0N
DOUT0_P: R6.2 U3.W5(IO_DIFFIO_TX_RX_B1n) ; port DOUT0P
DOUT1_N: R7.2 U3.V4(IO_DIFFIO_RX_B2n) ; port DOUT1N
DOUT1_P: R7.1 U3.V5(IO_DIFFIO_RX_B2p) ; port DOUT1P
DOUT2_N: R8.2 U3.U6(IO_DIFFIO_TX_RX_B3n) ; port DOUT2N
DOUT2_P: R8.1 U3.U7(IO_DIFFIO_TX_RX_B3p) ; port DOUT2P
DOUT3_N: R9.2 U3.Y1(IO_DIFFIO_RX_B4n) ; port DOUT3N
DOUT3_P: R9.1 U3.Y2(IO_DIFFIO_RX_B4p) ; port DOUT3P
MISO0: U3.V8(IO_DIFFIO_TX_RX_B7p) ; port MISO0
MON0: U3.AA2(IO_DIFFIO_RX_B6p) ; port MON0
MON1: U3.AA1(IO_DIFFIO_RX_B6n) ; port MON1
MOSI0: U3.Y5(IO_DIFFIO_RX_B8n) ; port MOSI0
RSTN: U3.R9(IO_DIFFIO_TX_RX_B9n) ; port RSTN
SCK0: U3.V7(IO_DIFFIO_TX_RX_B7n) ; port SCK0
SSN0: U3.Y6(IO_DIFFIO_RX_B8p) ; port SSN0
SYNC_N: R10.2 U3.W4(IO_DIFFIO_TX_RX_B5n) ; port SYNCN
SYNC_P: R10.1 U3.W3(IO_DIFFIO_TX_RX_B5p) ; port SYNCP
TRG0: U3.P9(IO_DIFFIO_TX_RX_B9p) ; port TRG0
TRG1: U3.Y7(IO_DIFFIO_RX_B10n) ; port TRG1
TRG2: U3.Y8(IO_DIFFIO_RX_B10p) ; port TRG2
NetR86_1: U3.AB2(IO_DIFFIO_RX_B12n) ; port PGOOD
NetU3_P11: U3.P11(IO_CLK7p_DIFFIO_TX_RX_B20p) X2.3(OUT)
NetU3_W9: U3.W9(IO_DIFFIO_TX_RX_B11n) ; port S5
NetU3_W10: U3.W10(IO_DIFFIO_TX_RX_B11p) ; port S3

Not connected (* = marked no-connect by the designer): U3 AA3(IO_VREFB3N0)* AA5(IO_DIFFIO_RX_B17n)* AA6(IO_DIFFIO_TX_RX_B16n)* AA7(IO_DIFFIO_TX_RX_B16p)* AA8(IO_DIFFIO_RX_B21n)* AA9(IO_DIFFIO_RX_B23n)* AA10(IO_DIFFIO_TX_RX_B22p)* AB3(IO_DIFFIO_RX_B12p) AB4(IO)* AB5(IO_DIFFIO_RX_B17p)* AB6(IO_DIFFIO_RX_B19n)* AB7(IO_DIFFIO_RX_B19p)* AB8(IO_DIFFIO_RX_B21p)* AB9(IO_DIFFIO_RX_B23p)* P10(IO_DIFFIO_TX_RX_B15p)* R10(IO_DIFFIO_TX_RX_B15n) W7(IO_DIFFIO_TX_RX_B13n) W8(IO_DIFFIO_TX_RX_B13p) Y3(IO_DIFFIO_RX_B14n) Y4(IO_DIFFIO_RX_B14p) Y10(IO_DIFFIO_TX_RX_B22n)*; X2 1(TS)*

### Layout directives
mark named Data_out: (no net found under the mark)
mark named Out_Clock: (no net found under the mark)
mark named Monitor: (no net found under the mark)
mark named SPI_Interface0: (no net found under the mark)
mark named RST: TRG1
mark named DDR2 Power Supply Control: (no net found under the mark)

### Notes on the sheet
- Python camera FPGA interface
- (in symbol Component_1, part D) BANK3

### Library data of the parts
C37-C40 = Component_1
  C37 C39: Buying URL:: https://uk.farnell.com/avx/08053d475kat2a/cap-4-7-f-25v-10-x5r-0805/dp/1657932?st=4.7u%200805
  C38 C40: Buying URL:: https://uk.farnell.com/avx/0603yc105kat2a/cap-1-f-16v-10-x7r-0603/dp/1658870RL?st=1u%200603
R5-R10 = RP73D1J76R8BTDG: as R2 on sheet [03]-Python_Camera_Interface; Buying URL:: https://uk.farnell.com/yageo/rc0402fr-07100rl/res-100r-1-0-0625w-0402-thick/dp/9239111
U3 = Component_1: Part no.: 10M25DAF484I7G
X2 = Component_1: mf_part no.: DSC1001CL5-040.0000; Manufactured by: MICROCHIP